# EAGLE schematic OSH_2018 (EAGLE 9.1.3)

## Sheet 1 of 4
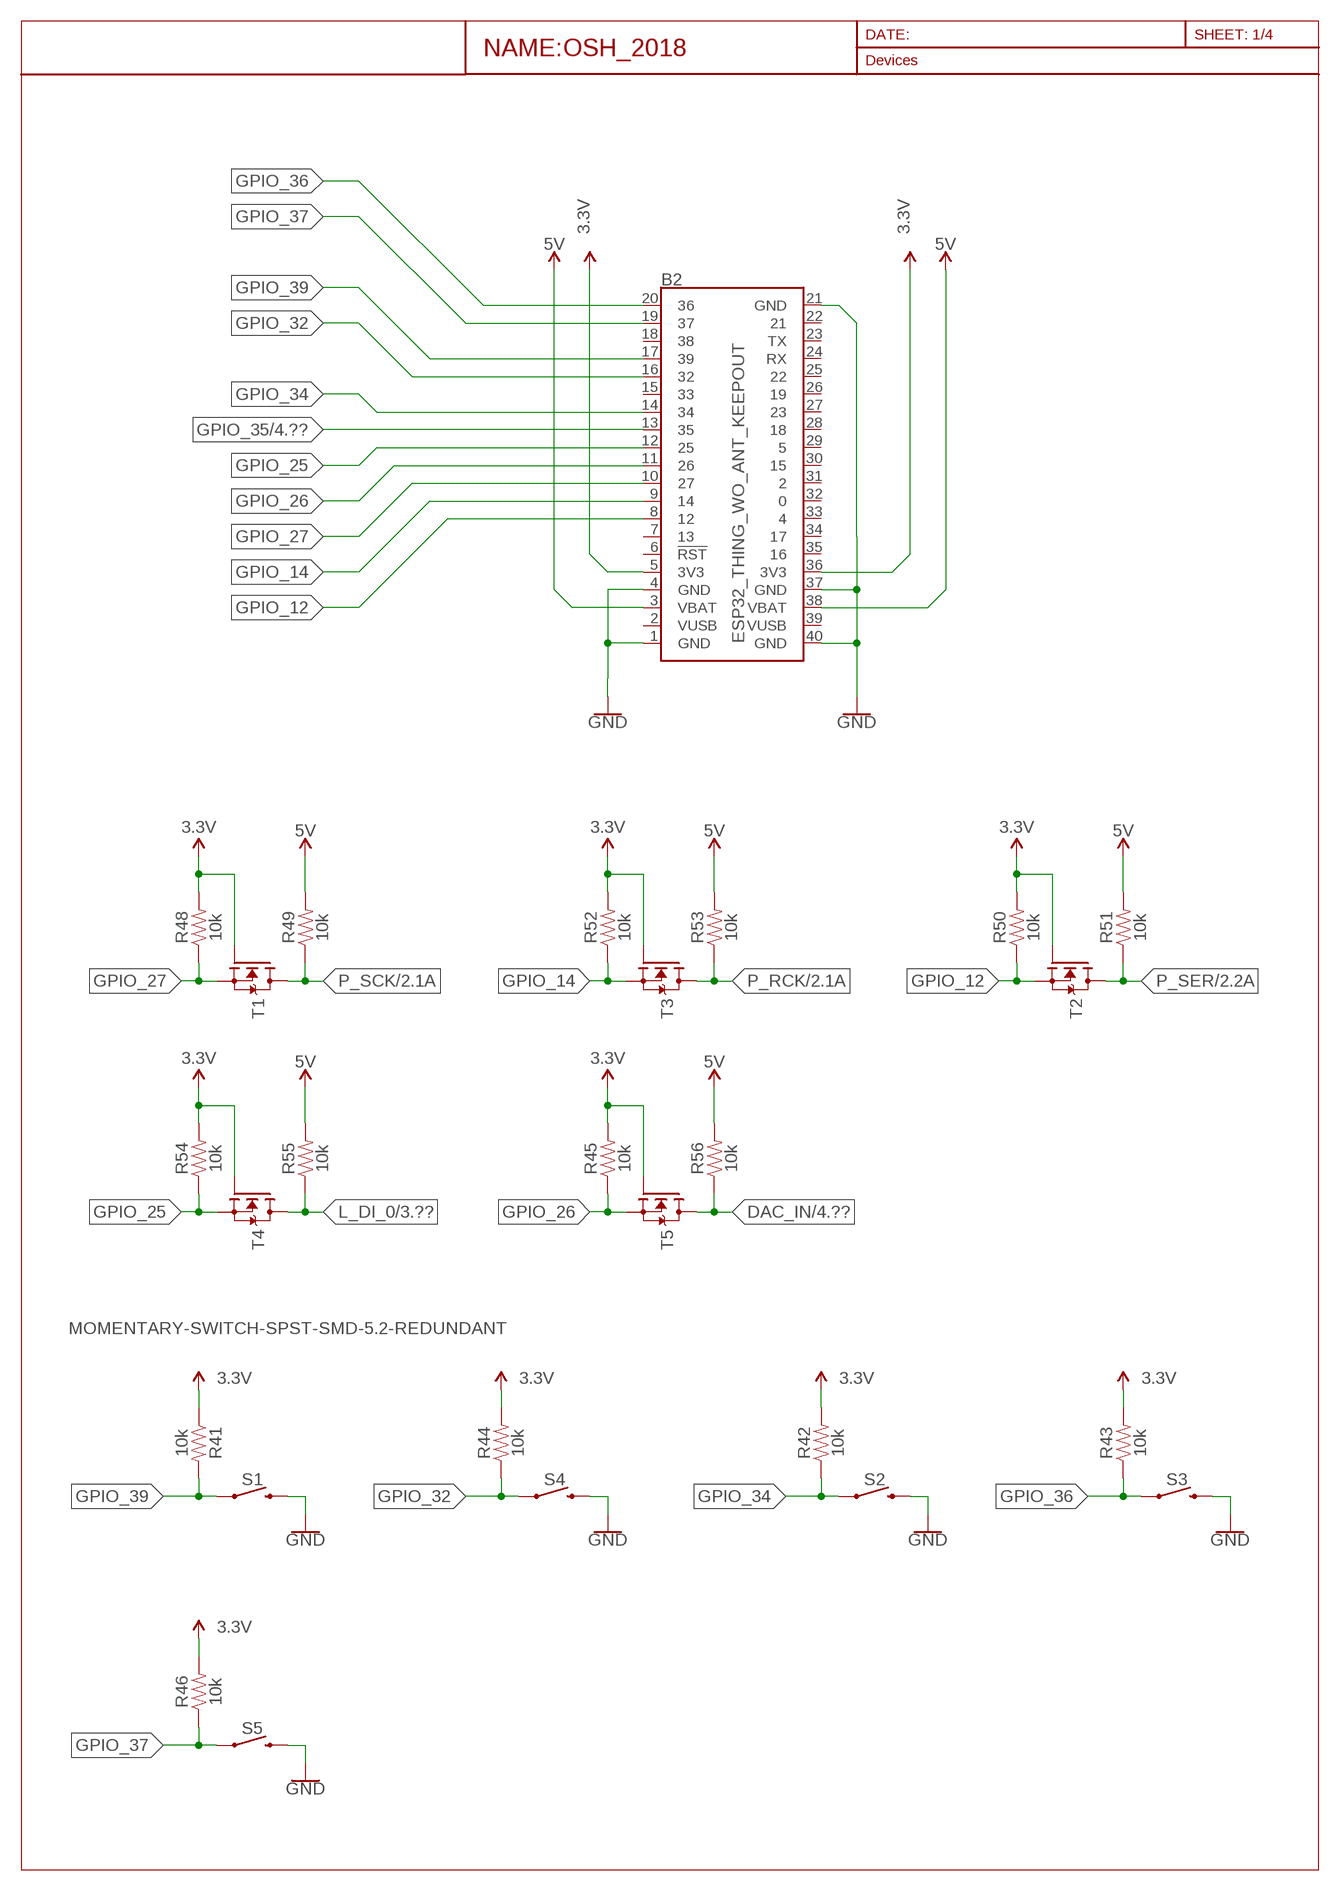
[diagram p0: schematic, sheet 1]

### Parts
B2  ESP32_THING_WO_ANT_KEEPOUT  [ESP32_THING_NO_ANT]
R41  10k  10KOHM-0603-1/10W-1%  [0603]
R42  10k  10KOHM-0603-1/10W-1%  [0603]
R43  10k  10KOHM-0603-1/10W-1%  [0603]
R44  10k  10KOHM-0603-1/10W-1%  [0603]
R45  10k  10KOHM-0603-1/10W-1%  [0603]
R46  10k  10KOHM-0603-1/10W-1%  [0603]
R48  10k  10KOHM-0603-1/10W-1%  [0603]
R49  10k  10KOHM-0603-1/10W-1%  [0603]
R50  10k  10KOHM-0603-1/10W-1%  [0603]
R51  10k  10KOHM-0603-1/10W-1%  [0603]
R52  10k  10KOHM-0603-1/10W-1%  [0603]
R53  10k  10KOHM-0603-1/10W-1%  [0603]
R54  10k  10KOHM-0603-1/10W-1%  [0603]
R55  10k  10KOHM-0603-1/10W-1%  [0603]
R56  10k  10KOHM-0603-1/10W-1%  [0603]
S1  MOMENTARY-SWITCH-SPST-SMD-5.2-REDUNDANT  [TACTILE_SWITCH_SMD_5.2MM]
S2  MOMENTARY-SWITCH-SPST-SMD-5.2-REDUNDANT  [TACTILE_SWITCH_SMD_5.2MM]
S3  MOMENTARY-SWITCH-SPST-SMD-5.2-REDUNDANT  [TACTILE_SWITCH_SMD_5.2MM]
S4  MOMENTARY-SWITCH-SPST-SMD-5.2-REDUNDANT  [TACTILE_SWITCH_SMD_5.2MM]
S5  MOMENTARY-SWITCH-SPST-SMD-5.2-REDUNDANT  [TACTILE_SWITCH_SMD_5.2MM]
T1  MOSFET-N-SOT23  [SOT23]
T2  MOSFET-N-SOT23  [SOT23]
T3  MOSFET-N-SOT23  [SOT23]
T4  MOSFET-N-SOT23  [SOT23]
T5  MOSFET-N-SOT23  [SOT23]

### Nets
3.3V: B2.5(3V3) B2.36(3V3) R41.1 R42.2 R43.2 R44.2 R45.2 R46.2 R48.2 R50.2 R52.2 R54.2 T1.1(G) T2.1(G) T3.1(G) T4.1(G) T5.1(G)
5V: B2.3(VBAT) B2.38(VBAT) R49.2 R51.2 R53.2 R55.2 R56.2 ; also sheet 2,3,4
DAC_IN: R56.1 T5.3(D) ; also sheet 4
GND: B2.1(GND) B2.4(GND) B2.21(GND) B2.37(GND) B2.40(GND) S1.3 S1.4 S2.3 S2.4 S3.3 S3.4 S4.3 S4.4 S5.3 S5.4 ; also sheet 2,3,4
GPIO_12: B2.8 R50.1 T2.2(S)
GPIO_14: B2.9 R52.1 T3.2(S)
GPIO_25: B2.12 R54.1 T4.2(S)
GPIO_26: B2.11 R45.1 T5.2(S)
GPIO_27: B2.10 R48.1 T1.2(S)
GPIO_32: B2.16 R44.1 S4.1 S4.2
GPIO_34: B2.14 R42.1 S2.1 S2.2
GPIO_35: B2.13 ; also sheet 4
GPIO_36: B2.20 R43.1 S3.1 S3.2
GPIO_37: B2.19 R46.1 S5.1 S5.2
GPIO_39: B2.17 R41.2 S1.1 S1.2
L_DI_0: R55.1 T4.3(D) ; also sheet 3
P_RCK: R53.1 T3.3(D) ; also sheet 2
P_SCK: R49.1 T1.3(D) ; also sheet 2
P_SER: R51.1 T2.3(D) ; also sheet 2
Unconnected: B2.2(VUSB) B2.6(!RST!) B2.7 B2.15 B2.18 B2.22 B2.23(TX) B2.24(RX) B2.25 B2.26 B2.27 B2.28 B2.29 B2.30 B2.31 B2.32 B2.33 B2.34 B2.35 B2.39(VUSB)

## Sheet 2 of 4: Configuracion de display de 8 segmentos
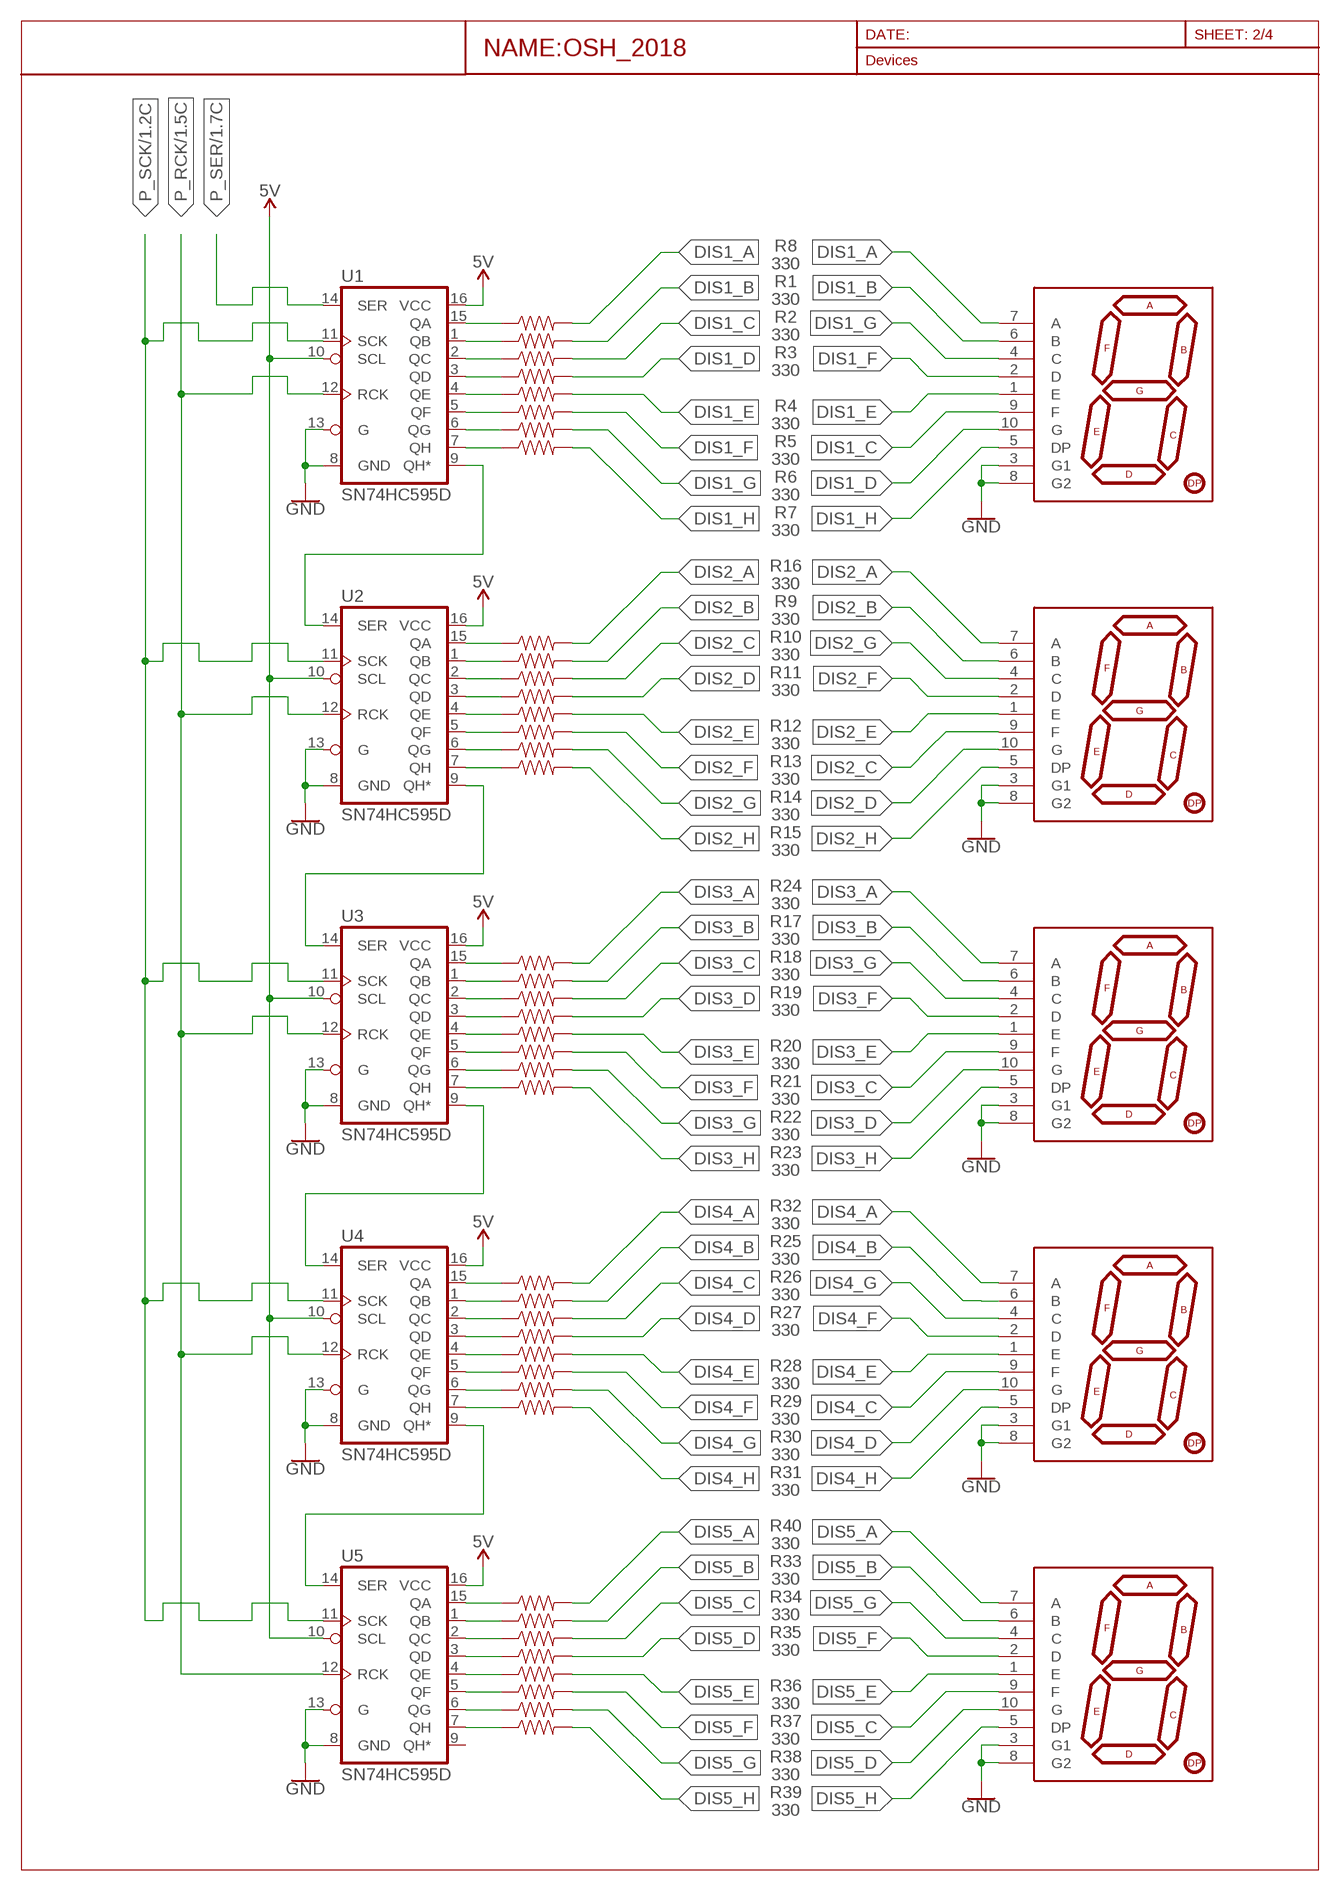
[diagram p1: schematic, sheet 2]

### Parts
DISPLAY_1  YSD-160AB3C-8  7-SEGMENT-1DIGIT-1INCH-BLUE  [7-SEGMENT-1"PTH]
DISPLAY_2  YSD-160AB3C-8  7-SEGMENT-1DIGIT-1INCH-BLUE  [7-SEGMENT-1"PTH]
DISPLAY_3  YSD-160AB3C-8  7-SEGMENT-1DIGIT-1INCH-BLUE  [7-SEGMENT-1"PTH]
DISPLAY_4  YSD-160AB3C-8  7-SEGMENT-1DIGIT-1INCH-BLUE  [7-SEGMENT-1"PTH]
DISPLAY_5  YSD-160AB3C-8  7-SEGMENT-1DIGIT-1INCH-BLUE  [7-SEGMENT-1"PTH]
R1  330  330OHM-0603-1/10W-1%  [0603]
R2  330  330OHM-0603-1/10W-1%  [0603]
R3  330  330OHM-0603-1/10W-1%  [0603]
R4  330  330OHM-0603-1/10W-1%  [0603]
R5  330  330OHM-0603-1/10W-1%  [0603]
R6  330  330OHM-0603-1/10W-1%  [0603]
R7  330  330OHM-0603-1/10W-1%  [0603]
R8  330  330OHM-0603-1/10W-1%  [0603]
R9  330  330OHM-0603-1/10W-1%  [0603]
R10  330  330OHM-0603-1/10W-1%  [0603]
R11  330  330OHM-0603-1/10W-1%  [0603]
R12  330  330OHM-0603-1/10W-1%  [0603]
R13  330  330OHM-0603-1/10W-1%  [0603]
R14  330  330OHM-0603-1/10W-1%  [0603]
R15  330  330OHM-0603-1/10W-1%  [0603]
R16  330  330OHM-0603-1/10W-1%  [0603]
R17  330  330OHM-0603-1/10W-1%  [0603]
R18  330  330OHM-0603-1/10W-1%  [0603]
R19  330  330OHM-0603-1/10W-1%  [0603]
R20  330  330OHM-0603-1/10W-1%  [0603]
R21  330  330OHM-0603-1/10W-1%  [0603]
R22  330  330OHM-0603-1/10W-1%  [0603]
R23  330  330OHM-0603-1/10W-1%  [0603]
R24  330  330OHM-0603-1/10W-1%  [0603]
R25  330  330OHM-0603-1/10W-1%  [0603]
R26  330  330OHM-0603-1/10W-1%  [0603]
R27  330  330OHM-0603-1/10W-1%  [0603]
R28  330  330OHM-0603-1/10W-1%  [0603]
R29  330  330OHM-0603-1/10W-1%  [0603]
R30  330  330OHM-0603-1/10W-1%  [0603]
R31  330  330OHM-0603-1/10W-1%  [0603]
R32  330  330OHM-0603-1/10W-1%  [0603]
R33  330  330OHM-0603-1/10W-1%  [0603]
R34  330  330OHM-0603-1/10W-1%  [0603]
R35  330  330OHM-0603-1/10W-1%  [0603]
R36  330  330OHM-0603-1/10W-1%  [0603]
R37  330  330OHM-0603-1/10W-1%  [0603]
R38  330  330OHM-0603-1/10W-1%  [0603]
R39  330  330OHM-0603-1/10W-1%  [0603]
R40  330  330OHM-0603-1/10W-1%  [0603]
U1  SN74HC595D  74HC595D  [SO16]
U2  SN74HC595D  74HC595D  [SO16]
U3  SN74HC595D  74HC595D  [SO16]
U4  SN74HC595D  74HC595D  [SO16]
U5  SN74HC595D  74HC595D  [SO16]

### Nets
5V: U1.10(SCL) U1.16(VCC) U2.10(SCL) U2.16(VCC) U3.10(SCL) U3.16(VCC) U4.10(SCL) U4.16(VCC) U5.10(SCL) U5.16(VCC) ; also sheet 1,3,4
DIS1_A: DISPLAY_1.7(A) R8.2
DIS1_B: DISPLAY_1.6(B) R1.2
DIS1_C: DISPLAY_1.9(F) R2.2
DIS1_D: DISPLAY_1.10(G) R3.2
DIS1_E: DISPLAY_1.1(E) R4.2
DIS1_F: DISPLAY_1.2(D) R5.2
DIS1_G: DISPLAY_1.4(C) R6.2
DIS1_H: DISPLAY_1.5(DP) R7.2
DIS2_A: DISPLAY_2.7(A) R9.2
DIS2_B: DISPLAY_2.6(B) R10.2
DIS2_C: DISPLAY_2.9(F) R11.2
DIS2_D: DISPLAY_2.10(G) R12.2
DIS2_E: DISPLAY_2.1(E) R13.2
DIS2_F: DISPLAY_2.2(D) R14.2
DIS2_G: DISPLAY_2.4(C) R15.2
DIS2_H: DISPLAY_2.5(DP) R16.2
DIS3_A: DISPLAY_3.7(A) R17.2
DIS3_B: DISPLAY_3.6(B) R18.2
DIS3_C: DISPLAY_3.9(F) R19.2
DIS3_D: DISPLAY_3.10(G) R20.2
DIS3_E: DISPLAY_3.1(E) R21.2
DIS3_F: DISPLAY_3.2(D) R22.2
DIS3_G: DISPLAY_3.4(C) R23.2
DIS3_H: DISPLAY_3.5(DP) R24.2
DIS4_A: DISPLAY_4.7(A) R25.2
DIS4_B: DISPLAY_4.6(B) R26.2
DIS4_C: DISPLAY_4.9(F) R27.2
DIS4_D: DISPLAY_4.10(G) R28.2
DIS4_E: DISPLAY_4.1(E) R29.2
DIS4_F: DISPLAY_4.2(D) R30.2
DIS4_G: DISPLAY_4.4(C) R31.2
DIS4_H: DISPLAY_4.5(DP) R32.2
DIS5_A: DISPLAY_5.7(A) R33.2
DIS5_B: DISPLAY_5.6(B) R34.2
DIS5_C: DISPLAY_5.9(F) R35.2
DIS5_D: DISPLAY_5.10(G) R36.2
DIS5_E: DISPLAY_5.1(E) R37.2
DIS5_F: DISPLAY_5.2(D) R38.2
DIS5_G: DISPLAY_5.4(C) R39.2
DIS5_H: DISPLAY_5.5(DP) R40.2
GND: DISPLAY_1.3(G1) DISPLAY_1.8(G2) DISPLAY_2.3(G1) DISPLAY_2.8(G2) DISPLAY_3.3(G1) DISPLAY_3.8(G2) DISPLAY_4.3(G1) DISPLAY_4.8(G2) DISPLAY_5.3(G1) DISPLAY_5.8(G2) U1.8(GND) U1.13(G) U2.8(GND) U2.13(G) U3.8(GND) U3.13(G) U4.8(GND) U4.13(G) U5.8(GND) U5.13(G) ; also sheet 1,3,4
N$110: R8.1 U1.15(QA)
N$121: R1.1 U1.1(QB)
N$122: R2.1 U1.2(QC)
N$123: R3.1 U1.3(QD)
N$124: R4.1 U1.4(QE)
N$125: R5.1 U1.5(QF)
N$126: R6.1 U1.6(QG)
N$127: R7.1 U1.7(QH)
N$141: R9.1 U2.15(QA)
N$142: R10.1 U2.1(QB)
N$143: R11.1 U2.2(QC)
N$144: R12.1 U2.3(QD)
N$145: R13.1 U2.4(QE)
N$146: R14.1 U2.5(QF)
N$157: R15.1 U2.6(QG)
N$158: R16.1 U2.7(QH)
N$177: R17.1 U3.15(QA)
N$178: R18.1 U3.1(QB)
N$179: R19.1 U3.2(QC)
N$180: R20.1 U3.3(QD)
N$181: R21.1 U3.4(QE)
N$182: R22.1 U3.5(QF)
N$193: R23.1 U3.6(QG)
N$194: R24.1 U3.7(QH)
N$195: R25.1 U4.15(QA)
N$196: R26.1 U4.1(QB)
N$221: R27.1 U4.2(QC)
N$222: R28.1 U4.3(QD)
N$223: R29.1 U4.4(QE)
N$224: R30.1 U4.5(QF)
N$225: R31.1 U4.6(QG)
N$226: R32.1 U4.7(QH)
N$235: R33.1 U5.15(QA)
N$236: R34.1 U5.1(QB)
N$237: R35.1 U5.2(QC)
N$238: R36.1 U5.3(QD)
N$239: R37.1 U5.4(QE)
N$240: R38.1 U5.5(QF)
N$241: R39.1 U5.6(QG)
N$242: R40.1 U5.7(QH)
N$251: U1.9(QH*) U2.14(SER)
N$252: U2.9(QH*) U3.14(SER)
N$253: U3.9(QH*) U4.14(SER)
N$254: U4.9(QH*) U5.14(SER)
P_RCK: U1.12(RCK) U2.12(RCK) U3.12(RCK) U4.12(RCK) U5.12(RCK) ; also sheet 1
P_SCK: U1.11(SCK) U2.11(SCK) U3.11(SCK) U4.11(SCK) U5.11(SCK) ; also sheet 1
P_SER: U1.14(SER) ; also sheet 1
Unconnected: U5.9(QH*)

## Sheet 3 of 4: Matrix LED 15x15
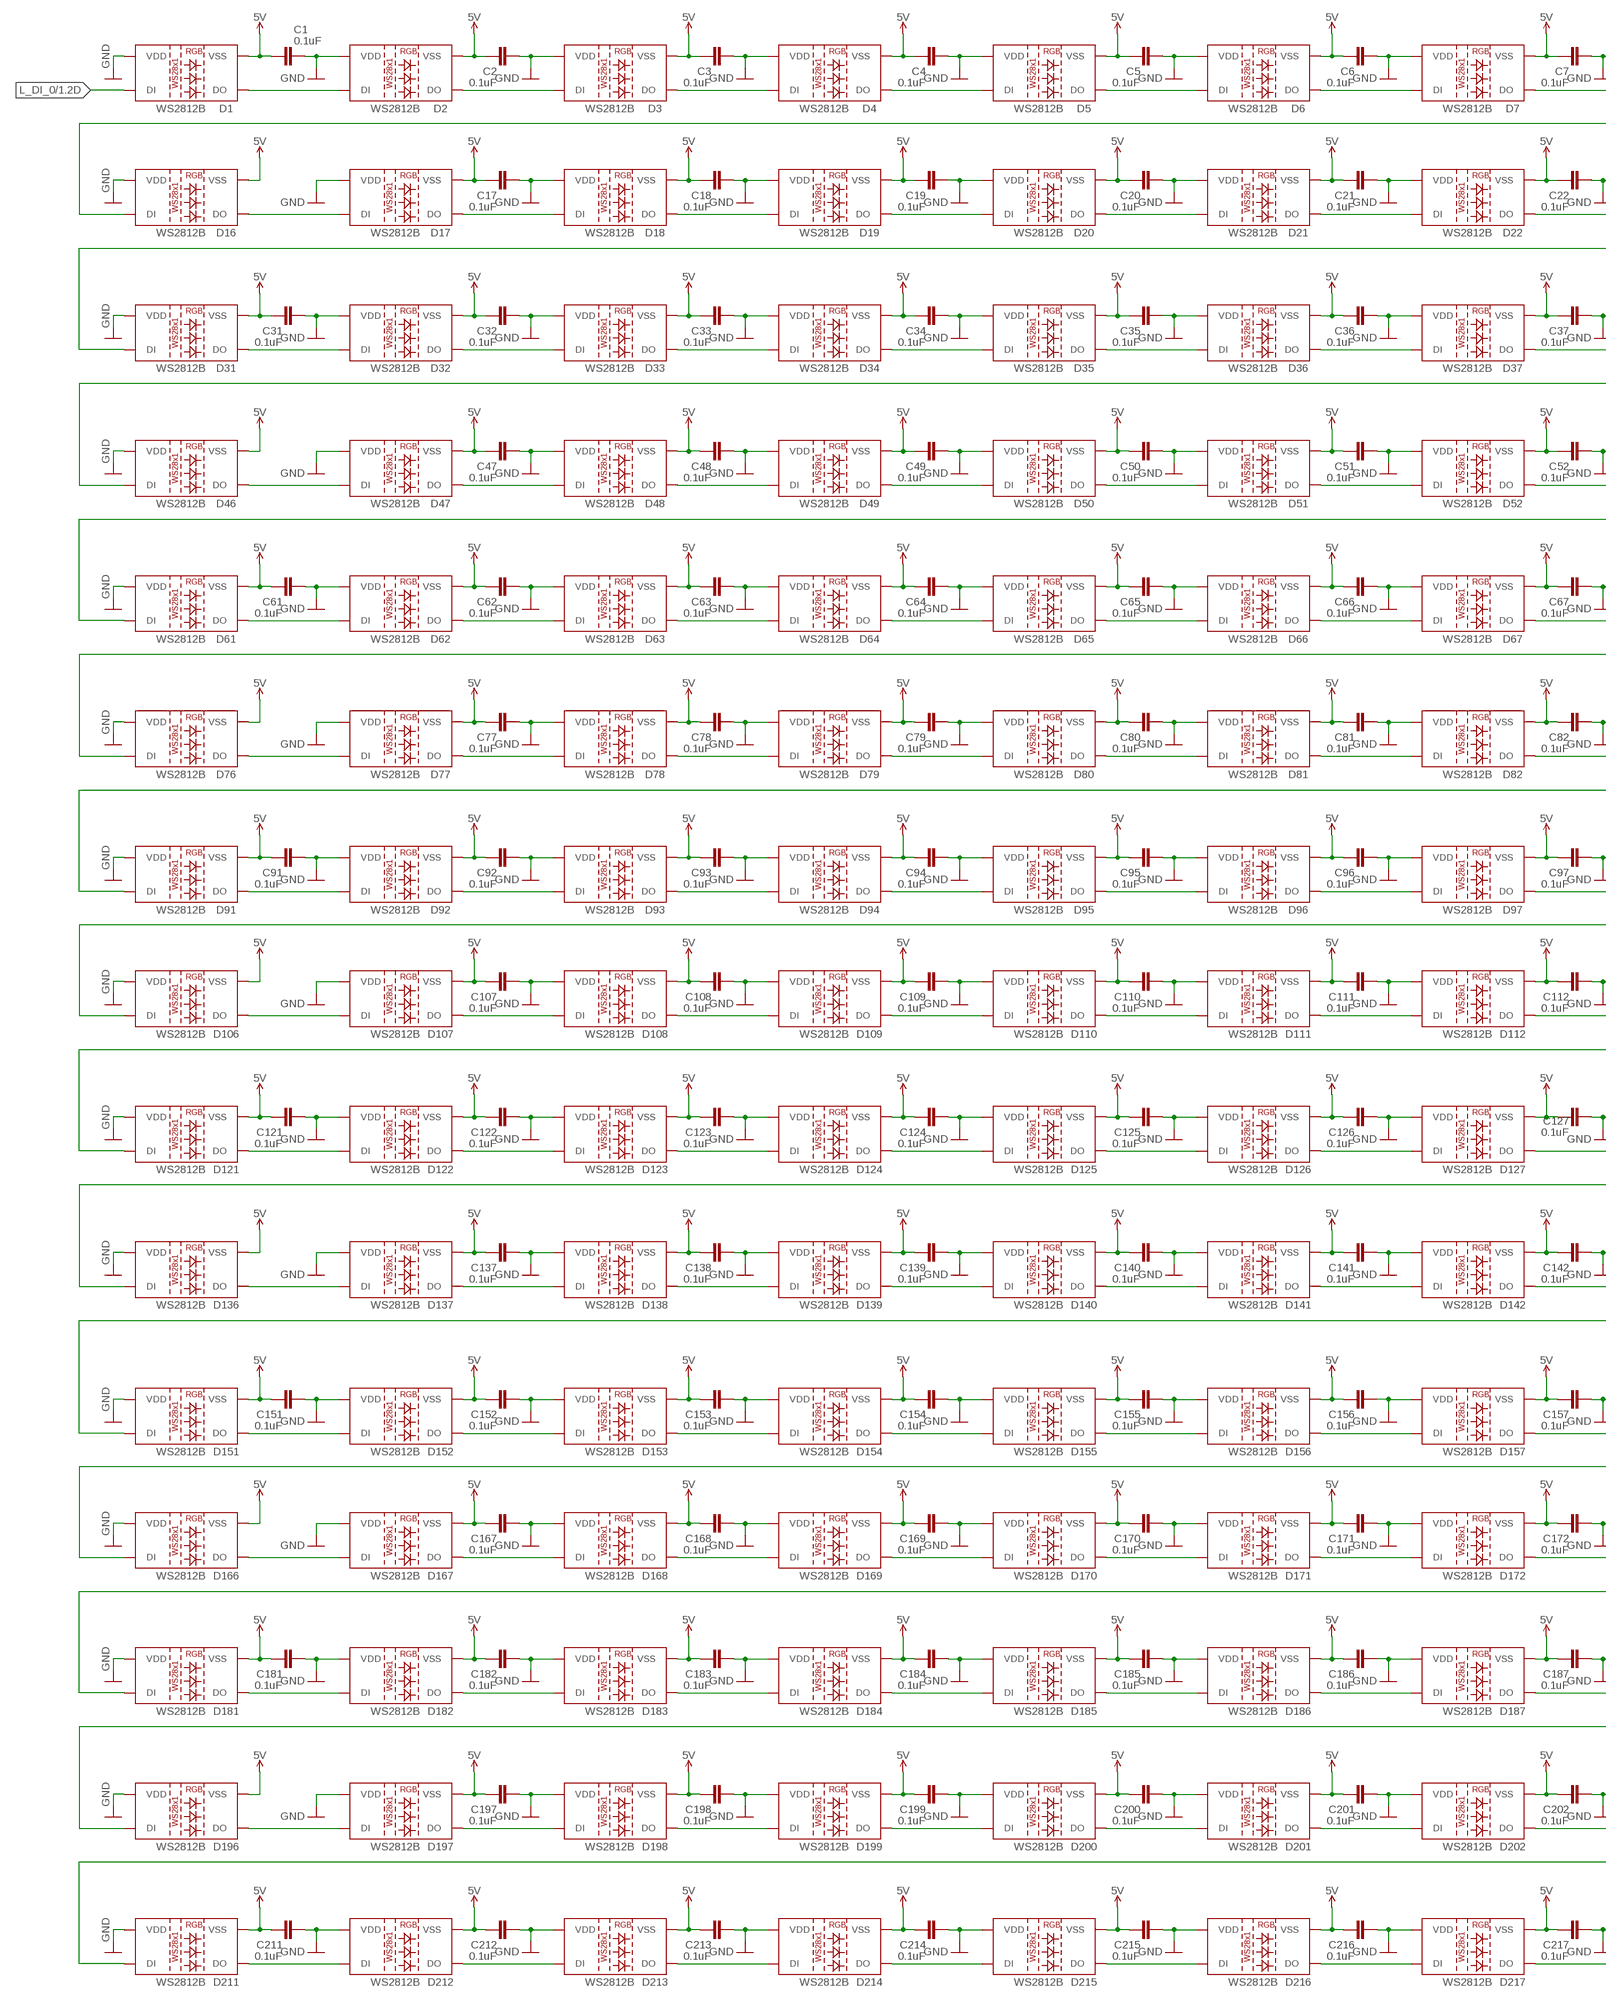
[diagram p2: schematic, sheet 3, part 1 of 2]
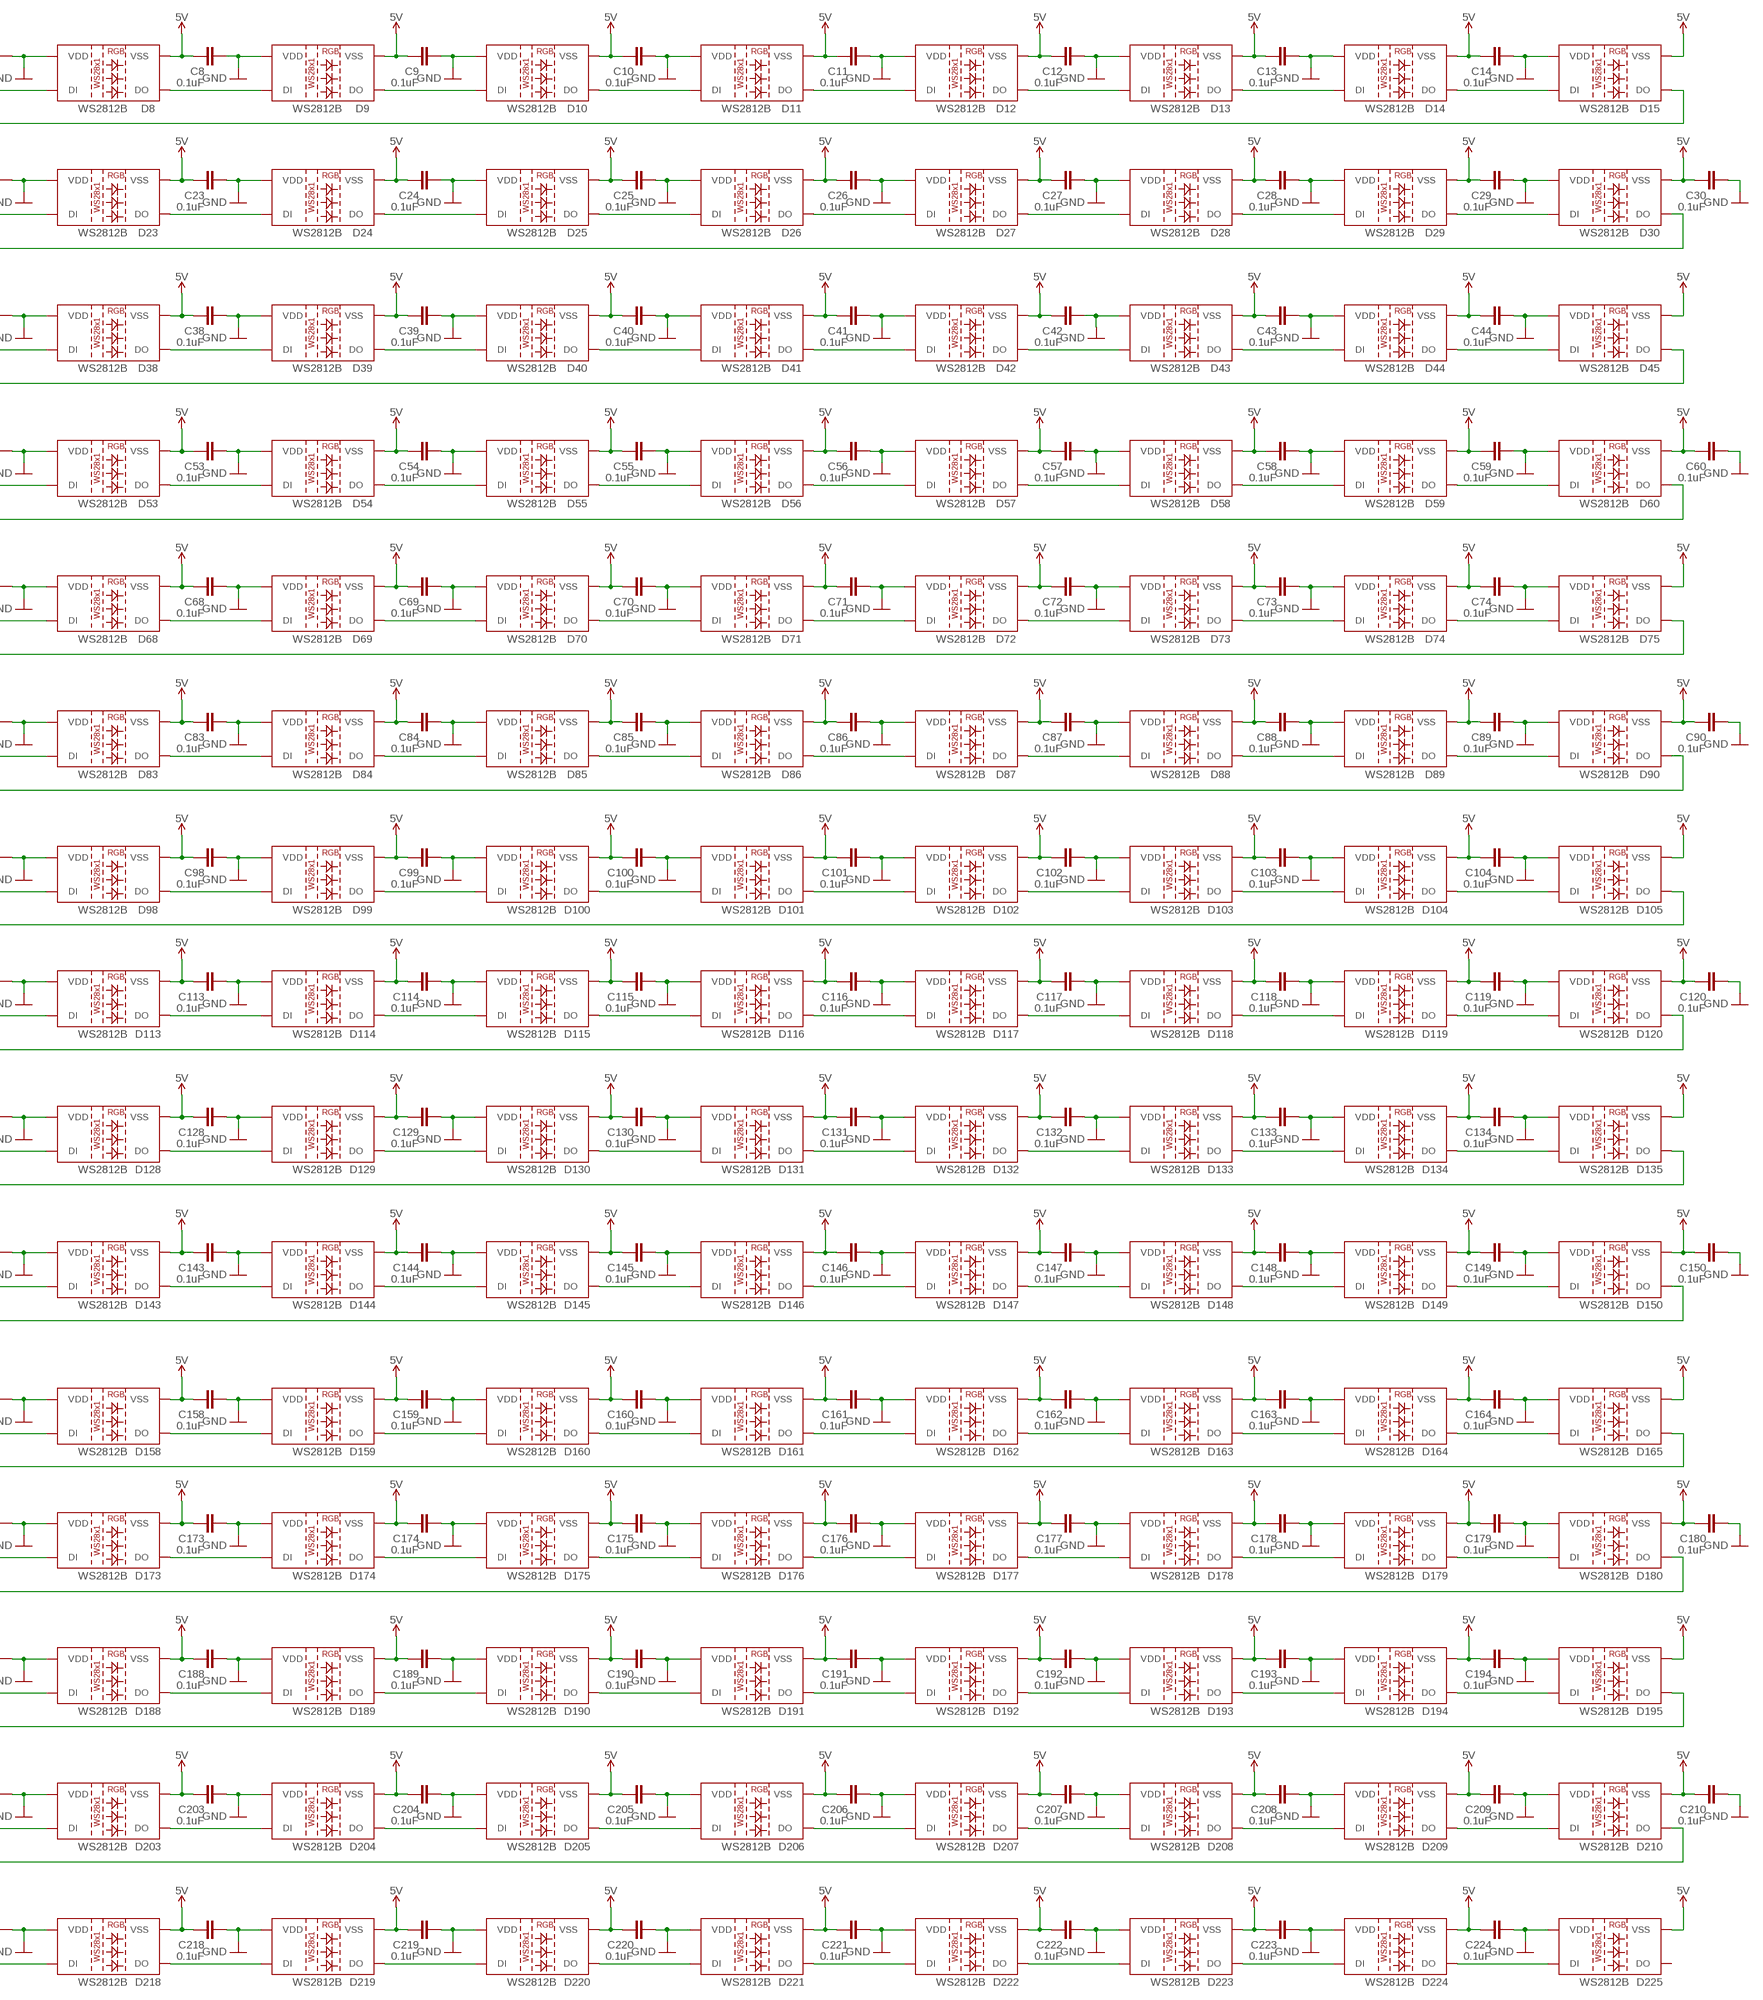
[diagram p3: schematic, sheet 3, part 2 of 2]

### Parts
C1  0.1uF  0.1UF-0603-25V-5%  [0603]
C2  0.1uF  0.1UF-0603-25V-5%  [0603]
C3  0.1uF  0.1UF-0603-25V-5%  [0603]
C4  0.1uF  0.1UF-0603-25V-5%  [0603]
C5  0.1uF  0.1UF-0603-25V-5%  [0603]
C6  0.1uF  0.1UF-0603-25V-5%  [0603]
C7  0.1uF  0.1UF-0603-25V-5%  [0603]
C8  0.1uF  0.1UF-0603-25V-5%  [0603]
C9  0.1uF  0.1UF-0603-25V-5%  [0603]
C10  0.1uF  0.1UF-0603-25V-5%  [0603]
C11  0.1uF  0.1UF-0603-25V-5%  [0603]
C12  0.1uF  0.1UF-0603-25V-5%  [0603]
C13  0.1uF  0.1UF-0603-25V-5%  [0603]
C14  0.1uF  0.1UF-0603-25V-5%  [0603]
C17  0.1uF  0.1UF-0603-25V-5%  [0603]
C18  0.1uF  0.1UF-0603-25V-5%  [0603]
C19  0.1uF  0.1UF-0603-25V-5%  [0603]
C20  0.1uF  0.1UF-0603-25V-5%  [0603]
C21  0.1uF  0.1UF-0603-25V-5%  [0603]
C22  0.1uF  0.1UF-0603-25V-5%  [0603]
C23  0.1uF  0.1UF-0603-25V-5%  [0603]
C24  0.1uF  0.1UF-0603-25V-5%  [0603]
C25  0.1uF  0.1UF-0603-25V-5%  [0603]
C26  0.1uF  0.1UF-0603-25V-5%  [0603]
C27  0.1uF  0.1UF-0603-25V-5%  [0603]
C28  0.1uF  0.1UF-0603-25V-5%  [0603]
C29  0.1uF  0.1UF-0603-25V-5%  [0603]
C30  0.1uF  0.1UF-0603-25V-5%  [0603]
C31  0.1uF  0.1UF-0603-25V-5%  [0603]
C32  0.1uF  0.1UF-0603-25V-5%  [0603]
C33  0.1uF  0.1UF-0603-25V-5%  [0603]
C34  0.1uF  0.1UF-0603-25V-5%  [0603]
C35  0.1uF  0.1UF-0603-25V-5%  [0603]
C36  0.1uF  0.1UF-0603-25V-5%  [0603]
C37  0.1uF  0.1UF-0603-25V-5%  [0603]
C38  0.1uF  0.1UF-0603-25V-5%  [0603]
C39  0.1uF  0.1UF-0603-25V-5%  [0603]
C40  0.1uF  0.1UF-0603-25V-5%  [0603]
C41  0.1uF  0.1UF-0603-25V-5%  [0603]
C42  0.1uF  0.1UF-0603-25V-5%  [0603]
C43  0.1uF  0.1UF-0603-25V-5%  [0603]
C44  0.1uF  0.1UF-0603-25V-5%  [0603]
C47  0.1uF  0.1UF-0603-25V-5%  [0603]
C48  0.1uF  0.1UF-0603-25V-5%  [0603]
C49  0.1uF  0.1UF-0603-25V-5%  [0603]
C50  0.1uF  0.1UF-0603-25V-5%  [0603]
C51  0.1uF  0.1UF-0603-25V-5%  [0603]
C52  0.1uF  0.1UF-0603-25V-5%  [0603]
C53  0.1uF  0.1UF-0603-25V-5%  [0603]
C54  0.1uF  0.1UF-0603-25V-5%  [0603]
C55  0.1uF  0.1UF-0603-25V-5%  [0603]
C56  0.1uF  0.1UF-0603-25V-5%  [0603]
C57  0.1uF  0.1UF-0603-25V-5%  [0603]
C58  0.1uF  0.1UF-0603-25V-5%  [0603]
C59  0.1uF  0.1UF-0603-25V-5%  [0603]
C60  0.1uF  0.1UF-0603-25V-5%  [0603]
C61  0.1uF  0.1UF-0603-25V-5%  [0603]
C62  0.1uF  0.1UF-0603-25V-5%  [0603]
C63  0.1uF  0.1UF-0603-25V-5%  [0603]
C64  0.1uF  0.1UF-0603-25V-5%  [0603]
C65  0.1uF  0.1UF-0603-25V-5%  [0603]
C66  0.1uF  0.1UF-0603-25V-5%  [0603]
C67  0.1uF  0.1UF-0603-25V-5%  [0603]
C68  0.1uF  0.1UF-0603-25V-5%  [0603]
C69  0.1uF  0.1UF-0603-25V-5%  [0603]
C70  0.1uF  0.1UF-0603-25V-5%  [0603]
C71  0.1uF  0.1UF-0603-25V-5%  [0603]
C72  0.1uF  0.1UF-0603-25V-5%  [0603]
C73  0.1uF  0.1UF-0603-25V-5%  [0603]
C74  0.1uF  0.1UF-0603-25V-5%  [0603]
C77  0.1uF  0.1UF-0603-25V-5%  [0603]
C78  0.1uF  0.1UF-0603-25V-5%  [0603]
C79  0.1uF  0.1UF-0603-25V-5%  [0603]
C80  0.1uF  0.1UF-0603-25V-5%  [0603]
C81  0.1uF  0.1UF-0603-25V-5%  [0603]
C82  0.1uF  0.1UF-0603-25V-5%  [0603]
C83  0.1uF  0.1UF-0603-25V-5%  [0603]
C84  0.1uF  0.1UF-0603-25V-5%  [0603]
C85  0.1uF  0.1UF-0603-25V-5%  [0603]
C86  0.1uF  0.1UF-0603-25V-5%  [0603]
C87  0.1uF  0.1UF-0603-25V-5%  [0603]
C88  0.1uF  0.1UF-0603-25V-5%  [0603]
C89  0.1uF  0.1UF-0603-25V-5%  [0603]
C90  0.1uF  0.1UF-0603-25V-5%  [0603]
C91  0.1uF  0.1UF-0603-25V-5%  [0603]
C92  0.1uF  0.1UF-0603-25V-5%  [0603]
C93  0.1uF  0.1UF-0603-25V-5%  [0603]
C94  0.1uF  0.1UF-0603-25V-5%  [0603]
C95  0.1uF  0.1UF-0603-25V-5%  [0603]
C96  0.1uF  0.1UF-0603-25V-5%  [0603]
C97  0.1uF  0.1UF-0603-25V-5%  [0603]
C98  0.1uF  0.1UF-0603-25V-5%  [0603]
C99  0.1uF  0.1UF-0603-25V-5%  [0603]
C100  0.1uF  0.1UF-0603-25V-5%  [0603]
C101  0.1uF  0.1UF-0603-25V-5%  [0603]
C102  0.1uF  0.1UF-0603-25V-5%  [0603]
C103  0.1uF  0.1UF-0603-25V-5%  [0603]
C104  0.1uF  0.1UF-0603-25V-5%  [0603]
C107  0.1uF  0.1UF-0603-25V-5%  [0603]
C108  0.1uF  0.1UF-0603-25V-5%  [0603]
C109  0.1uF  0.1UF-0603-25V-5%  [0603]
C110  0.1uF  0.1UF-0603-25V-5%  [0603]
C111  0.1uF  0.1UF-0603-25V-5%  [0603]
C112  0.1uF  0.1UF-0603-25V-5%  [0603]
C113  0.1uF  0.1UF-0603-25V-5%  [0603]
C114  0.1uF  0.1UF-0603-25V-5%  [0603]
C115  0.1uF  0.1UF-0603-25V-5%  [0603]
C116  0.1uF  0.1UF-0603-25V-5%  [0603]
C117  0.1uF  0.1UF-0603-25V-5%  [0603]
C118  0.1uF  0.1UF-0603-25V-5%  [0603]
C119  0.1uF  0.1UF-0603-25V-5%  [0603]
C120  0.1uF  0.1UF-0603-25V-5%  [0603]
C121  0.1uF  0.1UF-0603-25V-5%  [0603]
C122  0.1uF  0.1UF-0603-25V-5%  [0603]
C123  0.1uF  0.1UF-0603-25V-5%  [0603]
C124  0.1uF  0.1UF-0603-25V-5%  [0603]
C125  0.1uF  0.1UF-0603-25V-5%  [0603]
C126  0.1uF  0.1UF-0603-25V-5%  [0603]
C127  0.1uF  0.1UF-0603-25V-5%  [0603]
C128  0.1uF  0.1UF-0603-25V-5%  [0603]
C129  0.1uF  0.1UF-0603-25V-5%  [0603]
C130  0.1uF  0.1UF-0603-25V-5%  [0603]
C131  0.1uF  0.1UF-0603-25V-5%  [0603]
C132  0.1uF  0.1UF-0603-25V-5%  [0603]
C133  0.1uF  0.1UF-0603-25V-5%  [0603]
C134  0.1uF  0.1UF-0603-25V-5%  [0603]
C137  0.1uF  0.1UF-0603-25V-5%  [0603]
C138  0.1uF  0.1UF-0603-25V-5%  [0603]
C139  0.1uF  0.1UF-0603-25V-5%  [0603]
C140  0.1uF  0.1UF-0603-25V-5%  [0603]
C141  0.1uF  0.1UF-0603-25V-5%  [0603]
C142  0.1uF  0.1UF-0603-25V-5%  [0603]
C143  0.1uF  0.1UF-0603-25V-5%  [0603]
C144  0.1uF  0.1UF-0603-25V-5%  [0603]
C145  0.1uF  0.1UF-0603-25V-5%  [0603]
C146  0.1uF  0.1UF-0603-25V-5%  [0603]
C147  0.1uF  0.1UF-0603-25V-5%  [0603]
C148  0.1uF  0.1UF-0603-25V-5%  [0603]
C149  0.1uF  0.1UF-0603-25V-5%  [0603]
C150  0.1uF  0.1UF-0603-25V-5%  [0603]
C151  0.1uF  0.1UF-0603-25V-5%  [0603]
C152  0.1uF  0.1UF-0603-25V-5%  [0603]
C153  0.1uF  0.1UF-0603-25V-5%  [0603]
C154  0.1uF  0.1UF-0603-25V-5%  [0603]
C155  0.1uF  0.1UF-0603-25V-5%  [0603]
C156  0.1uF  0.1UF-0603-25V-5%  [0603]
C157  0.1uF  0.1UF-0603-25V-5%  [0603]
C158  0.1uF  0.1UF-0603-25V-5%  [0603]
C159  0.1uF  0.1UF-0603-25V-5%  [0603]
C160  0.1uF  0.1UF-0603-25V-5%  [0603]
C161  0.1uF  0.1UF-0603-25V-5%  [0603]
C162  0.1uF  0.1UF-0603-25V-5%  [0603]
C163  0.1uF  0.1UF-0603-25V-5%  [0603]
C164  0.1uF  0.1UF-0603-25V-5%  [0603]
C167  0.1uF  0.1UF-0603-25V-5%  [0603]
C168  0.1uF  0.1UF-0603-25V-5%  [0603]
C169  0.1uF  0.1UF-0603-25V-5%  [0603]
C170  0.1uF  0.1UF-0603-25V-5%  [0603]
C171  0.1uF  0.1UF-0603-25V-5%  [0603]
C172  0.1uF  0.1UF-0603-25V-5%  [0603]
C173  0.1uF  0.1UF-0603-25V-5%  [0603]
C174  0.1uF  0.1UF-0603-25V-5%  [0603]
C175  0.1uF  0.1UF-0603-25V-5%  [0603]
C176  0.1uF  0.1UF-0603-25V-5%  [0603]
C177  0.1uF  0.1UF-0603-25V-5%  [0603]
C178  0.1uF  0.1UF-0603-25V-5%  [0603]
C179  0.1uF  0.1UF-0603-25V-5%  [0603]
C180  0.1uF  0.1UF-0603-25V-5%  [0603]
C181  0.1uF  0.1UF-0603-25V-5%  [0603]
C182  0.1uF  0.1UF-0603-100V-10%  [0603]
C183  0.1uF  0.1UF-0603-25V-5%  [0603]
C184  0.1uF  0.1UF-0603-25V-5%  [0603]
C185  0.1uF  0.1UF-0603-25V-5%  [0603]
C186  0.1uF  0.1UF-0603-25V-5%  [0603]
C187  0.1uF  0.1UF-0603-25V-5%  [0603]
C188  0.1uF  0.1UF-0603-25V-5%  [0603]
C189  0.1uF  0.1UF-0603-25V-5%  [0603]
C190  0.1uF  0.1UF-0603-25V-5%  [0603]
C191  0.1uF  0.1UF-0603-25V-5%  [0603]
C192  0.1uF  0.1UF-0603-25V-5%  [0603]
C193  0.1uF  0.1UF-0603-25V-5%  [0603]
C194  0.1uF  0.1UF-0603-25V-5%  [0603]
C197  0.1uF  0.1UF-0603-25V-5%  [0603]
C198  0.1uF  0.1UF-0603-25V-5%  [0603]
C199  0.1uF  0.1UF-0603-25V-5%  [0603]
C200  0.1uF  0.1UF-0603-25V-5%  [0603]
C201  0.1uF  0.1UF-0603-25V-5%  [0603]
C202  0.1uF  0.1UF-0603-25V-5%  [0603]
C203  0.1uF  0.1UF-0603-25V-5%  [0603]
C204  0.1uF  0.1UF-0603-25V-5%  [0603]
C205  0.1uF  0.1UF-0603-25V-5%  [0603]
C206  0.1uF  0.1UF-0603-25V-5%  [0603]
C207  0.1uF  0.1UF-0603-25V-5%  [0603]
C208  0.1uF  0.1UF-0603-25V-5%  [0603]
C209  0.1uF  0.1UF-0603-25V-5%  [0603]
C210  0.1uF  0.1UF-0603-25V-5%  [0603]
C211  0.1uF  0.1UF-0603-25V-5%  [0603]
C212  0.1uF  0.1UF-0603-25V-5%  [0603]
C213  0.1uF  0.1UF-0603-25V-5%  [0603]
C214  0.1uF  0.1UF-0603-25V-5%  [0603]
C215  0.1uF  0.1UF-0603-25V-5%  [0603]
C216  0.1uF  0.1UF-0603-25V-5%  [0603]
C217  0.1uF  0.1UF-0603-25V-5%  [0603]
C218  0.1uF  0.1UF-0603-25V-5%  [0603]
C219  0.1uF  0.1UF-0603-25V-5%  [0603]
C220  0.1uF  0.1UF-0603-25V-5%  [0603]
C221  0.1uF  0.1UF-0603-25V-5%  [0603]
C222  0.1uF  0.1UF-0603-25V-5%  [0603]
C223  0.1uF  0.1UF-0603-25V-5%  [0603]
C224  0.1uF  0.1UF-0603-25V-5%  [0603]
D1  WS2812B  [WS2812B]
D2  WS2812B  [WS2812B]
D3  WS2812B  [WS2812B]
D4  WS2812B  [WS2812B]
D5  WS2812B  [WS2812B]
D6  WS2812B  [WS2812B]
D7  WS2812B  [WS2812B]
D8  WS2812B  [WS2812B]
D9  WS2812B  [WS2812B]
D10  WS2812B  [WS2812B]
D11  WS2812B  [WS2812B]
D12  WS2812B  [WS2812B]
D13  WS2812B  [WS2812B]
D14  WS2812B  [WS2812B]
D15  WS2812B  [WS2812B]
D16  WS2812B  [WS2812B]
D17  WS2812B  [WS2812B]
D18  WS2812B  [WS2812B]
D19  WS2812B  [WS2812B]
D20  WS2812B  [WS2812B]
D21  WS2812B  [WS2812B]
D22  WS2812B  [WS2812B]
D23  WS2812B  [WS2812B]
D24  WS2812B  [WS2812B]
D25  WS2812B  [WS2812B]
D26  WS2812B  [WS2812B]
D27  WS2812B  [WS2812B]
D28  WS2812B  [WS2812B]
D29  WS2812B  [WS2812B]
D30  WS2812B  [WS2812B]
D31  WS2812B  [WS2812B]
D32  WS2812B  [WS2812B]
D33  WS2812B  [WS2812B]
D34  WS2812B  [WS2812B]
D35  WS2812B  [WS2812B]
D36  WS2812B  [WS2812B]
D37  WS2812B  [WS2812B]
D38  WS2812B  [WS2812B]
D39  WS2812B  [WS2812B]
D40  WS2812B  [WS2812B]
D41  WS2812B  [WS2812B]
D42  WS2812B  [WS2812B]
D43  WS2812B  [WS2812B]
D44  WS2812B  [WS2812B]
D45  WS2812B  [WS2812B]
D46  WS2812B  [WS2812B]
D47  WS2812B  [WS2812B]
D48  WS2812B  [WS2812B]
D49  WS2812B  [WS2812B]
D50  WS2812B  [WS2812B]
D51  WS2812B  [WS2812B]
D52  WS2812B  [WS2812B]
D53  WS2812B  [WS2812B]
D54  WS2812B  [WS2812B]
D55  WS2812B  [WS2812B]
D56  WS2812B  [WS2812B]
D57  WS2812B  [WS2812B]
D58  WS2812B  [WS2812B]
D59  WS2812B  [WS2812B]
D60  WS2812B  [WS2812B]
D61  WS2812B  [WS2812B]
D62  WS2812B  [WS2812B]
D63  WS2812B  [WS2812B]
D64  WS2812B  [WS2812B]
D65  WS2812B  [WS2812B]
D66  WS2812B  [WS2812B]
D67  WS2812B  [WS2812B]
D68  WS2812B  [WS2812B]
D69  WS2812B  [WS2812B]
D70  WS2812B  [WS2812B]
D71  WS2812B  [WS2812B]
D72  WS2812B  [WS2812B]
D73  WS2812B  [WS2812B]
D74  WS2812B  [WS2812B]
D75  WS2812B  [WS2812B]
D76  WS2812B  [WS2812B]
D77  WS2812B  [WS2812B]
D78  WS2812B  [WS2812B]
D79  WS2812B  [WS2812B]
D80  WS2812B  [WS2812B]
D81  WS2812B  [WS2812B]
D82  WS2812B  [WS2812B]
D83  WS2812B  [WS2812B]
D84  WS2812B  [WS2812B]
D85  WS2812B  [WS2812B]
D86  WS2812B  [WS2812B]
D87  WS2812B  [WS2812B]
D88  WS2812B  [WS2812B]
D89  WS2812B  [WS2812B]
D90  WS2812B  [WS2812B]
D91  WS2812B  [WS2812B]
D92  WS2812B  [WS2812B]
D93  WS2812B  [WS2812B]
D94  WS2812B  [WS2812B]
D95  WS2812B  [WS2812B]
D96  WS2812B  [WS2812B]
D97  WS2812B  [WS2812B]
D98  WS2812B  [WS2812B]
D99  WS2812B  [WS2812B]
D100  WS2812B  [WS2812B]
D101  WS2812B  [WS2812B]
D102  WS2812B  [WS2812B]
D103  WS2812B  [WS2812B]
D104  WS2812B  [WS2812B]
D105  WS2812B  [WS2812B]
D106  WS2812B  [WS2812B]
D107  WS2812B  [WS2812B]
D108  WS2812B  [WS2812B]
D109  WS2812B  [WS2812B]
D110  WS2812B  [WS2812B]
D111  WS2812B  [WS2812B]
D112  WS2812B  [WS2812B]
D113  WS2812B  [WS2812B]
D114  WS2812B  [WS2812B]
D115  WS2812B  [WS2812B]
D116  WS2812B  [WS2812B]
D117  WS2812B  [WS2812B]
D118  WS2812B  [WS2812B]
D119  WS2812B  [WS2812B]
D120  WS2812B  [WS2812B]
D121  WS2812B  [WS2812B]
D122  WS2812B  [WS2812B]
D123  WS2812B  [WS2812B]
D124  WS2812B  [WS2812B]
D125  WS2812B  [WS2812B]
D126  WS2812B  [WS2812B]
D127  WS2812B  [WS2812B]
D128  WS2812B  [WS2812B]
D129  WS2812B  [WS2812B]
D130  WS2812B  [WS2812B]
D131  WS2812B  [WS2812B]
D132  WS2812B  [WS2812B]
D133  WS2812B  [WS2812B]
D134  WS2812B  [WS2812B]
D135  WS2812B  [WS2812B]
D136  WS2812B  [WS2812B]
D137  WS2812B  [WS2812B]
D138  WS2812B  [WS2812B]
D139  WS2812B  [WS2812B]
D140  WS2812B  [WS2812B]
D141  WS2812B  [WS2812B]
D142  WS2812B  [WS2812B]
D143  WS2812B  [WS2812B]
D144  WS2812B  [WS2812B]
D145  WS2812B  [WS2812B]
D146  WS2812B  [WS2812B]
D147  WS2812B  [WS2812B]
D148  WS2812B  [WS2812B]
D149  WS2812B  [WS2812B]
D150  WS2812B  [WS2812B]
D151  WS2812B  [WS2812B]
D152  WS2812B  [WS2812B]
D153  WS2812B  [WS2812B]
D154  WS2812B  [WS2812B]
D155  WS2812B  [WS2812B]
D156  WS2812B  [WS2812B]
D157  WS2812B  [WS2812B]
D158  WS2812B  [WS2812B]
D159  WS2812B  [WS2812B]
D160  WS2812B  [WS2812B]
D161  WS2812B  [WS2812B]
D162  WS2812B  [WS2812B]
D163  WS2812B  [WS2812B]
D164  WS2812B  [WS2812B]
D165  WS2812B  [WS2812B]
D166  WS2812B  [WS2812B]
D167  WS2812B  [WS2812B]
D168  WS2812B  [WS2812B]
D169  WS2812B  [WS2812B]
D170  WS2812B  [WS2812B]
D171  WS2812B  [WS2812B]
D172  WS2812B  [WS2812B]
D173  WS2812B  [WS2812B]
D174  WS2812B  [WS2812B]
D175  WS2812B  [WS2812B]
D176  WS2812B  [WS2812B]
D177  WS2812B  [WS2812B]
D178  WS2812B  [WS2812B]
D179  WS2812B  [WS2812B]
D180  WS2812B  [WS2812B]
D181  WS2812B  [WS2812B]
D182  WS2812B  [WS2812B]
D183  WS2812B  [WS2812B]
D184  WS2812B  [WS2812B]
D185  WS2812B  [WS2812B]
D186  WS2812B  [WS2812B]
D187  WS2812B  [WS2812B]
D188  WS2812B  [WS2812B]
D189  WS2812B  [WS2812B]
D190  WS2812B  [WS2812B]
D191  WS2812B  [WS2812B]
D192  WS2812B  [WS2812B]
D193  WS2812B  [WS2812B]
D194  WS2812B  [WS2812B]
D195  WS2812B  [WS2812B]
D196  WS2812B  [WS2812B]
D197  WS2812B  [WS2812B]
D198  WS2812B  [WS2812B]
D199  WS2812B  [WS2812B]
D200  WS2812B  [WS2812B]
D201  WS2812B  [WS2812B]
D202  WS2812B  [WS2812B]
D203  WS2812B  [WS2812B]
D204  WS2812B  [WS2812B]
D205  WS2812B  [WS2812B]
D206  WS2812B  [WS2812B]
D207  WS2812B  [WS2812B]
D208  WS2812B  [WS2812B]
D209  WS2812B  [WS2812B]
D210  WS2812B  [WS2812B]
D211  WS2812B  [WS2812B]
D212  WS2812B  [WS2812B]
D213  WS2812B  [WS2812B]
D214  WS2812B  [WS2812B]
D215  WS2812B  [WS2812B]
D216  WS2812B  [WS2812B]
D217  WS2812B  [WS2812B]
D218  WS2812B  [WS2812B]
D219  WS2812B  [WS2812B]
D220  WS2812B  [WS2812B]
D221  WS2812B  [WS2812B]
D222  WS2812B  [WS2812B]
D223  WS2812B  [WS2812B]
D224  WS2812B  [WS2812B]
D225  WS2812B  [WS2812B]

### Nets
5V: C1.1 C2.1 C3.1 C4.1 C5.1 C6.1 C7.1 C8.1 C9.1 C10.1 C11.1 C12.1 C13.1 C14.1 C17.1 C18.1 C19.1 C20.1 C21.1 C22.1 C23.1 C24.1 C25.1 C26.1 C27.1 C28.1 C29.1 C30.1 C31.1 C32.1 C33.1 C34.1 C35.1 C36.1 C37.1 C38.1 C39.1 C40.1 C41.1 C42.1 C43.1 C44.1 C47.1 C48.1 C49.1 C50.1 C51.1 C52.1 C53.1 C54.1 C55.1 C56.1 C57.1 C58.1 C59.1 C60.1 C61.1 C62.1 C63.1 C64.1 C65.1 C66.1 C67.1 C68.1 C69.1 C70.1 C71.1 C72.1 C73.1 C74.1 C77.1 C78.1 C79.1 C80.1 C81.1 C82.1 C83.1 C84.1 C85.1 C86.1 C87.1 C88.1 C89.1 C90.1 C91.1 C92.1 C93.1 C94.1 C95.1 C96.1 C97.1 C98.1 C99.1 C100.1 C101.1 C102.1 C103.1 C104.1 C107.1 C108.1 C109.1 C110.1 C111.1 C112.1 C113.1 C114.1 C115.1 C116.1 C117.1 C118.1 C119.1 C120.1 C121.1 C122.1 C123.1 C124.1 C125.1 C126.1 C127.1 C128.1 C129.1 C130.1 C131.1 C132.1 C133.1 C134.1 C137.1 C138.1 C139.1 C140.1 C141.1 C142.1 C143.1 C144.1 C145.1 C146.1 C147.1 C148.1 C149.1 C150.1 C151.1 C152.1 C153.1 C154.1 C155.1 C156.1 C157.1 C158.1 C159.1 C160.1 C161.1 C162.1 C163.1 C164.1 C167.1 C168.1 C169.1 C170.1 C171.1 C172.1 C173.1 C174.1 C175.1 C176.1 C177.1 C178.1 C179.1 C180.1 C181.1 C182.1 C183.1 C184.1 C185.1 C186.1 C187.1 C188.1 C189.1 C190.1 C191.1 C192.1 C193.1 C194.1 C197.1 C198.1 C199.1 C200.1 C201.1 C202.1 C203.1 C204.1 C205.1 C206.1 C207.1 C208.1 C209.1 C210.1 C211.1 C212.1 C213.1 C214.1 C215.1 C216.1 C217.1 C218.1 C219.1 C220.1 C221.1 C222.1 C223.1 C224.1 D1.3(VSS) D2.3(VSS) D3.3(VSS) D4.3(VSS) D5.3(VSS) D6.3(VSS) D7.3(VSS) D8.3(VSS) D9.3(VSS) D10.3(VSS) D11.3(VSS) D12.3(VSS) D13.3(VSS) D14.3(VSS) D15.3(VSS) D16.3(VSS) D17.3(VSS) D18.3(VSS) D19.3(VSS) D20.3(VSS) D21.3(VSS) D22.3(VSS) D23.3(VSS) D24.3(VSS) D25.3(VSS) D26.3(VSS) D27.3(VSS) D28.3(VSS) D29.3(VSS) D30.3(VSS) D31.3(VSS) D32.3(VSS) D33.3(VSS) D34.3(VSS) D35.3(VSS) D36.3(VSS) D37.3(VSS) D38.3(VSS) D39.3(VSS) D40.3(VSS) D41.3(VSS) D42.3(VSS) D43.3(VSS) D44.3(VSS) D45.3(VSS) D46.3(VSS) D47.3(VSS) D48.3(VSS) D49.3(VSS) D50.3(VSS) D51.3(VSS) D52.3(VSS) D53.3(VSS) D54.3(VSS) D55.3(VSS) D56.3(VSS) D57.3(VSS) D58.3(VSS) D59.3(VSS) D60.3(VSS) D61.3(VSS) D62.3(VSS) D63.3(VSS) D64.3(VSS) D65.3(VSS) D66.3(VSS) D67.3(VSS) D68.3(VSS) D69.3(VSS) D70.3(VSS) D71.3(VSS) D72.3(VSS) D73.3(VSS) D74.3(VSS) D75.3(VSS) D76.3(VSS) D77.3(VSS) D78.3(VSS) D79.3(VSS) D80.3(VSS) D81.3(VSS) D82.3(VSS) D83.3(VSS) D84.3(VSS) D85.3(VSS) D86.3(VSS) D87.3(VSS) D88.3(VSS) D89.3(VSS) D90.3(VSS) D91.3(VSS) D92.3(VSS) D93.3(VSS) D94.3(VSS) D95.3(VSS) D96.3(VSS) D97.3(VSS) D98.3(VSS) D99.3(VSS) D100.3(VSS) D101.3(VSS) D102.3(VSS) D103.3(VSS) D104.3(VSS) D105.3(VSS) D106.3(VSS) D107.3(VSS) D108.3(VSS) D109.3(VSS) D110.3(VSS) D111.3(VSS) D112.3(VSS) D113.3(VSS) D114.3(VSS) D115.3(VSS) D116.3(VSS) D117.3(VSS) D118.3(VSS) D119.3(VSS) D120.3(VSS) D121.3(VSS) D122.3(VSS) D123.3(VSS) D124.3(VSS) D125.3(VSS) D126.3(VSS) D127.3(VSS) D128.3(VSS) D129.3(VSS) D130.3(VSS) D131.3(VSS) D132.3(VSS) D133.3(VSS) D134.3(VSS) D135.3(VSS) D136.3(VSS) D137.3(VSS) D138.3(VSS) D139.3(VSS) D140.3(VSS) D141.3(VSS) D142.3(VSS) D143.3(VSS) D144.3(VSS) D145.3(VSS) D146.3(VSS) D147.3(VSS) D148.3(VSS) D149.3(VSS) D150.3(VSS) D151.3(VSS) D152.3(VSS) D153.3(VSS) D154.3(VSS) D155.3(VSS) D156.3(VSS) D157.3(VSS) D158.3(VSS) D159.3(VSS) D160.3(VSS) D161.3(VSS) D162.3(VSS) D163.3(VSS) D164.3(VSS) D165.3(VSS) D166.3(VSS) D167.3(VSS) D168.3(VSS) D169.3(VSS) D170.3(VSS) D171.3(VSS) D172.3(VSS) D173.3(VSS) D174.3(VSS) D175.3(VSS) D176.3(VSS) D177.3(VSS) D178.3(VSS) D179.3(VSS) D180.3(VSS) D181.3(VSS) D182.3(VSS) D183.3(VSS) D184.3(VSS) D185.3(VSS) D186.3(VSS) D187.3(VSS) D188.3(VSS) D189.3(VSS) D190.3(VSS) D191.3(VSS) D192.3(VSS) D193.3(VSS) D194.3(VSS) D195.3(VSS) D196.3(VSS) D197.3(VSS) D198.3(VSS) D199.3(VSS) D200.3(VSS) D201.3(VSS) D202.3(VSS) D203.3(VSS) D204.3(VSS) D205.3(VSS) D206.3(VSS) D207.3(VSS) D208.3(VSS) D209.3(VSS) D210.3(VSS) D211.3(VSS) D212.3(VSS) D213.3(VSS) D214.3(VSS) D215.3(VSS) D216.3(VSS) D217.3(VSS) D218.3(VSS) D219.3(VSS) D220.3(VSS) D221.3(VSS) D222.3(VSS) D223.3(VSS) D224.3(VSS) D225.3(VSS) ; also sheet 1,2,4
GND: C1.2 C2.2 C3.2 C4.2 C5.2 C6.2 C7.2 C8.2 C9.2 C10.2 C11.2 C12.2 C13.2 C14.2 C17.2 C18.2 C19.2 C20.2 C21.2 C22.2 C23.2 C24.2 C25.2 C26.2 C27.2 C28.2 C29.2 C30.2 C31.2 C32.2 C33.2 C34.2 C35.2 C36.2 C37.2 C38.2 C39.2 C40.2 C41.2 C42.2 C43.2 C44.2 C47.2 C48.2 C49.2 C50.2 C51.2 C52.2 C53.2 C54.2 C55.2 C56.2 C57.2 C58.2 C59.2 C60.2 C61.2 C62.2 C63.2 C64.2 C65.2 C66.2 C67.2 C68.2 C69.2 C70.2 C71.2 C72.2 C73.2 C74.2 C77.2 C78.2 C79.2 C80.2 C81.2 C82.2 C83.2 C84.2 C85.2 C86.2 C87.2 C88.2 C89.2 C90.2 C91.2 C92.2 C93.2 C94.2 C95.2 C96.2 C97.2 C98.2 C99.2 C100.2 C101.2 C102.2 C103.2 C104.2 C107.2 C108.2 C109.2 C110.2 C111.2 C112.2 C113.2 C114.2 C115.2 C116.2 C117.2 C118.2 C119.2 C120.2 C121.2 C122.2 C123.2 C124.2 C125.2 C126.2 C127.2 C128.2 C129.2 C130.2 C131.2 C132.2 C133.2 C134.2 C137.2 C138.2 C139.2 C140.2 C141.2 C142.2 C143.2 C144.2 C145.2 C146.2 C147.2 C148.2 C149.2 C150.2 C151.2 C152.2 C153.2 C154.2 C155.2 C156.2 C157.2 C158.2 C159.2 C160.2 C161.2 C162.2 C163.2 C164.2 C167.2 C168.2 C169.2 C170.2 C171.2 C172.2 C173.2 C174.2 C175.2 C176.2 C177.2 C178.2 C179.2 C180.2 C181.2 C182.2 C183.2 C184.2 C185.2 C186.2 C187.2 C188.2 C189.2 C190.2 C191.2 C192.2 C193.2 C194.2 C197.2 C198.2 C199.2 C200.2 C201.2 C202.2 C203.2 C204.2 C205.2 C206.2 C207.2 C208.2 C209.2 C210.2 C211.2 C212.2 C213.2 C214.2 C215.2 C216.2 C217.2 C218.2 C219.2 C220.2 C221.2 C222.2 C223.2 C224.2 D1.1(VDD) D2.1(VDD) D3.1(VDD) D4.1(VDD) D5.1(VDD) D6.1(VDD) D7.1(VDD) D8.1(VDD) D9.1(VDD) D10.1(VDD) D11.1(VDD) D12.1(VDD) D13.1(VDD) D14.1(VDD) D15.1(VDD) D16.1(VDD) D17.1(VDD) D18.1(VDD) D19.1(VDD) D20.1(VDD) D21.1(VDD) D22.1(VDD) D23.1(VDD) D24.1(VDD) D25.1(VDD) D26.1(VDD) D27.1(VDD) D28.1(VDD) D29.1(VDD) D30.1(VDD) D31.1(VDD) D32.1(VDD) D33.1(VDD) D34.1(VDD) D35.1(VDD) D36.1(VDD) D37.1(VDD) D38.1(VDD) D39.1(VDD) D40.1(VDD) D41.1(VDD) D42.1(VDD) D43.1(VDD) D44.1(VDD) D45.1(VDD) D46.1(VDD) D47.1(VDD) D48.1(VDD) D49.1(VDD) D50.1(VDD) D51.1(VDD) D52.1(VDD) D53.1(VDD) D54.1(VDD) D55.1(VDD) D56.1(VDD) D57.1(VDD) D58.1(VDD) D59.1(VDD) D60.1(VDD) D61.1(VDD) D62.1(VDD) D63.1(VDD) D64.1(VDD) D65.1(VDD) D66.1(VDD) D67.1(VDD) D68.1(VDD) D69.1(VDD) D70.1(VDD) D71.1(VDD) D72.1(VDD) D73.1(VDD) D74.1(VDD) D75.1(VDD) D76.1(VDD) D77.1(VDD) D78.1(VDD) D79.1(VDD) D80.1(VDD) D81.1(VDD) D82.1(VDD) D83.1(VDD) D84.1(VDD) D85.1(VDD) D86.1(VDD) D87.1(VDD) D88.1(VDD) D89.1(VDD) D90.1(VDD) D91.1(VDD) D92.1(VDD) D93.1(VDD) D94.1(VDD) D95.1(VDD) D96.1(VDD) D97.1(VDD) D98.1(VDD) D99.1(VDD) D100.1(VDD) D101.1(VDD) D102.1(VDD) D103.1(VDD) D104.1(VDD) D105.1(VDD) D106.1(VDD) D107.1(VDD) D108.1(VDD) D109.1(VDD) D110.1(VDD) D111.1(VDD) D112.1(VDD) D113.1(VDD) D114.1(VDD) D115.1(VDD) D116.1(VDD) D117.1(VDD) D118.1(VDD) D119.1(VDD) D120.1(VDD) D121.1(VDD) D122.1(VDD) D123.1(VDD) D124.1(VDD) D125.1(VDD) D126.1(VDD) D127.1(VDD) D128.1(VDD) D129.1(VDD) D130.1(VDD) D131.1(VDD) D132.1(VDD) D133.1(VDD) D134.1(VDD) D135.1(VDD) D136.1(VDD) D137.1(VDD) D138.1(VDD) D139.1(VDD) D140.1(VDD) D141.1(VDD) D142.1(VDD) D143.1(VDD) D144.1(VDD) D145.1(VDD) D146.1(VDD) D147.1(VDD) D148.1(VDD) D149.1(VDD) D150.1(VDD) D151.1(VDD) D152.1(VDD) D153.1(VDD) D154.1(VDD) D155.1(VDD) D156.1(VDD) D157.1(VDD) D158.1(VDD) D159.1(VDD) D160.1(VDD) D161.1(VDD) D162.1(VDD) D163.1(VDD) D164.1(VDD) D165.1(VDD) D166.1(VDD) D167.1(VDD) D168.1(VDD) D169.1(VDD) D170.1(VDD) D171.1(VDD) D172.1(VDD) D173.1(VDD) D174.1(VDD) D175.1(VDD) D176.1(VDD) D177.1(VDD) D178.1(VDD) D179.1(VDD) D180.1(VDD) D181.1(VDD) D182.1(VDD) D183.1(VDD) D184.1(VDD) D185.1(VDD) D186.1(VDD) D187.1(VDD) D188.1(VDD) D189.1(VDD) D190.1(VDD) D191.1(VDD) D192.1(VDD) D193.1(VDD) D194.1(VDD) D195.1(VDD) D196.1(VDD) D197.1(VDD) D198.1(VDD) D199.1(VDD) D200.1(VDD) D201.1(VDD) D202.1(VDD) D203.1(VDD) D204.1(VDD) D205.1(VDD) D206.1(VDD) D207.1(VDD) D208.1(VDD) D209.1(VDD) D210.1(VDD) D211.1(VDD) D212.1(VDD) D213.1(VDD) D214.1(VDD) D215.1(VDD) D216.1(VDD) D217.1(VDD) D218.1(VDD) D219.1(VDD) D220.1(VDD) D221.1(VDD) D222.1(VDD) D223.1(VDD) D224.1(VDD) D225.1(VDD) ; also sheet 1,2,4
L_DI_0: D1.4(DI) ; also sheet 1
N$1: D1.2(DO) D2.4(DI)
N$2: D2.2(DO) D3.4(DI)
N$3: D3.2(DO) D4.4(DI)
N$4: D4.2(DO) D5.4(DI)
N$5: D5.2(DO) D6.4(DI)
N$6: D6.2(DO) D7.4(DI)
N$7: D7.2(DO) D8.4(DI)
N$8: D8.2(DO) D9.4(DI)
N$9: D9.2(DO) D10.4(DI)
N$10: D10.2(DO) D11.4(DI)
N$11: D11.2(DO) D12.4(DI)
N$12: D12.2(DO) D13.4(DI)
N$13: D13.2(DO) D14.4(DI)
N$14: D14.2(DO) D15.4(DI)
N$15: D15.2(DO) D16.4(DI)
N$16: D16.2(DO) D17.4(DI)
N$17: D17.2(DO) D18.4(DI)
N$18: D18.2(DO) D19.4(DI)
N$19: D19.2(DO) D20.4(DI)
N$20: D20.2(DO) D21.4(DI)
N$21: D21.2(DO) D22.4(DI)
N$22: D22.2(DO) D23.4(DI)
N$23: D23.2(DO) D24.4(DI)
N$24: D24.2(DO) D25.4(DI)
N$25: D25.2(DO) D26.4(DI)
N$26: D26.2(DO) D27.4(DI)
N$27: D27.2(DO) D28.4(DI)
N$28: D28.2(DO) D29.4(DI)
N$29: D29.2(DO) D30.4(DI)
N$30: D30.2(DO) D31.4(DI)
N$31: D31.2(DO) D32.4(DI)
N$32: D32.2(DO) D33.4(DI)
N$33: D33.2(DO) D34.4(DI)
N$34: D34.2(DO) D35.4(DI)
N$35: D35.2(DO) D36.4(DI)
N$36: D36.2(DO) D37.4(DI)
N$37: D37.2(DO) D38.4(DI)
N$38: D38.2(DO) D39.4(DI)
N$39: D39.2(DO) D40.4(DI)
N$40: D40.2(DO) D41.4(DI)
N$41: D41.2(DO) D42.4(DI)
N$42: D42.2(DO) D43.4(DI)
N$43: D43.2(DO) D44.4(DI)
N$44: D44.2(DO) D45.4(DI)
N$45: D45.2(DO) D46.4(DI)
N$46: D46.2(DO) D47.4(DI)
N$47: D47.2(DO) D48.4(DI)
N$48: D48.2(DO) D49.4(DI)
N$49: D49.2(DO) D50.4(DI)
N$50: D50.2(DO) D51.4(DI)
N$51: D51.2(DO) D52.4(DI)
N$52: D52.2(DO) D53.4(DI)
N$53: D53.2(DO) D54.4(DI)
N$54: D54.2(DO) D55.4(DI)
N$55: D55.2(DO) D56.4(DI)
N$56: D56.2(DO) D57.4(DI)
N$57: D57.2(DO) D58.4(DI)
N$58: D58.2(DO) D59.4(DI)
N$59: D59.2(DO) D60.4(DI)
N$60: D60.2(DO) D61.4(DI)
N$61: D61.2(DO) D62.4(DI)
N$62: D62.2(DO) D63.4(DI)
N$63: D63.2(DO) D64.4(DI)
N$64: D64.2(DO) D65.4(DI)
N$65: D65.2(DO) D66.4(DI)
N$66: D66.2(DO) D67.4(DI)
N$67: D67.2(DO) D68.4(DI)
N$68: D68.2(DO) D69.4(DI)
N$69: D69.2(DO) D70.4(DI)
N$70: D70.2(DO) D71.4(DI)
N$71: D71.2(DO) D72.4(DI)
N$72: D72.2(DO) D73.4(DI)
N$73: D73.2(DO) D74.4(DI)
N$74: D74.2(DO) D75.4(DI)
N$75: D75.2(DO) D76.4(DI)
N$76: D76.2(DO) D77.4(DI)
N$77: D77.2(DO) D78.4(DI)
N$78: D78.2(DO) D79.4(DI)
N$79: D79.2(DO) D80.4(DI)
N$80: D80.2(DO) D81.4(DI)
N$81: D81.2(DO) D82.4(DI)
N$82: D82.2(DO) D83.4(DI)
N$83: D83.2(DO) D84.4(DI)
N$84: D84.2(DO) D85.4(DI)
N$85: D85.2(DO) D86.4(DI)
N$86: D86.2(DO) D87.4(DI)
N$87: D87.2(DO) D88.4(DI)
N$88: D88.2(DO) D89.4(DI)
N$89: D89.2(DO) D90.4(DI)
N$90: D90.2(DO) D91.4(DI)
N$91: D91.2(DO) D92.4(DI)
N$92: D92.2(DO) D93.4(DI)
N$93: D93.2(DO) D94.4(DI)
N$94: D94.2(DO) D95.4(DI)
N$95: D95.2(DO) D96.4(DI)
N$96: D96.2(DO) D97.4(DI)
N$97: D97.2(DO) D98.4(DI)
N$98: D98.2(DO) D99.4(DI)
N$99: D99.2(DO) D100.4(DI)
N$100: D100.2(DO) D101.4(DI)
N$101: D101.2(DO) D102.4(DI)
N$102: D102.2(DO) D103.4(DI)
N$103: D103.2(DO) D104.4(DI)
N$104: D104.2(DO) D105.4(DI)
N$105: D105.2(DO) D106.4(DI)
N$106: D106.2(DO) D107.4(DI)
N$107: D107.2(DO) D108.4(DI)
N$108: D108.2(DO) D109.4(DI)
N$109: D109.2(DO) D110.4(DI)
N$111: D110.2(DO) D111.4(DI)
N$112: D111.2(DO) D112.4(DI)
N$113: D112.2(DO) D113.4(DI)
N$114: D113.2(DO) D114.4(DI)
N$115: D114.2(DO) D115.4(DI)
N$116: D115.2(DO) D116.4(DI)
N$117: D116.2(DO) D117.4(DI)
N$118: D117.2(DO) D118.4(DI)
N$119: D118.2(DO) D119.4(DI)
N$120: D119.2(DO) D120.4(DI)
N$129: D120.2(DO) D121.4(DI)
N$130: D121.2(DO) D122.4(DI)
N$131: D122.2(DO) D123.4(DI)
N$132: D123.2(DO) D124.4(DI)
N$133: D124.2(DO) D125.4(DI)
N$134: D125.2(DO) D126.4(DI)
N$135: D126.2(DO) D127.4(DI)
N$136: D127.2(DO) D128.4(DI)
N$137: D128.2(DO) D129.4(DI)
N$138: D129.2(DO) D130.4(DI)
N$139: D130.2(DO) D131.4(DI)
N$147: D131.2(DO) D132.4(DI)
N$148: D132.2(DO) D133.4(DI)
N$149: D133.2(DO) D134.4(DI)
N$150: D134.2(DO) D135.4(DI)
N$151: D135.2(DO) D136.4(DI)
N$152: D136.2(DO) D137.4(DI)
N$153: D137.2(DO) D138.4(DI)
N$154: D138.2(DO) D139.4(DI)
N$155: D139.2(DO) D140.4(DI)
N$156: D140.2(DO) D141.4(DI)
N$165: D141.2(DO) D142.4(DI)
N$166: D142.2(DO) D143.4(DI)
N$167: D143.2(DO) D144.4(DI)
N$168: D144.2(DO) D145.4(DI)
N$169: D145.2(DO) D146.4(DI)
N$170: D146.2(DO) D147.4(DI)
N$171: D147.2(DO) D148.4(DI)
N$172: D148.2(DO) D149.4(DI)
N$173: D149.2(DO) D150.4(DI)
N$174: D150.2(DO) D151.4(DI)
N$183: D151.2(DO) D152.4(DI)
N$184: D152.2(DO) D153.4(DI)
N$185: D153.2(DO) D154.4(DI)
N$186: D154.2(DO) D155.4(DI)
N$187: D155.2(DO) D156.4(DI)
N$188: D156.2(DO) D157.4(DI)
N$189: D157.2(DO) D158.4(DI)
N$190: D158.2(DO) D159.4(DI)
N$191: D159.2(DO) D160.4(DI)
N$192: D160.2(DO) D161.4(DI)
N$201: D161.2(DO) D162.4(DI)
N$202: D162.2(DO) D163.4(DI)
N$203: D163.2(DO) D164.4(DI)
N$204: D164.2(DO) D165.4(DI)
N$205: D165.2(DO) D166.4(DI)
N$206: D166.2(DO) D167.4(DI)
N$207: D167.2(DO) D168.4(DI)
N$208: D168.2(DO) D169.4(DI)
N$209: D169.2(DO) D170.4(DI)
N$210: D170.2(DO) D171.4(DI)
N$255: D171.2(DO) D172.4(DI)
N$256: D172.2(DO) D173.4(DI)
N$257: D173.2(DO) D174.4(DI)
N$258: D174.2(DO) D175.4(DI)
N$259: D175.2(DO) D176.4(DI)
N$260: D176.2(DO) D177.4(DI)
N$261: D177.2(DO) D178.4(DI)
N$262: D178.2(DO) D179.4(DI)
N$263: D179.2(DO) D180.4(DI)
N$264: D180.2(DO) D181.4(DI)
N$265: D181.2(DO) D182.4(DI)
N$266: D182.2(DO) D183.4(DI)
N$267: D183.2(DO) D184.4(DI)
N$268: D184.2(DO) D185.4(DI)
N$269: D185.2(DO) D186.4(DI)
N$270: D186.2(DO) D187.4(DI)
N$271: D187.2(DO) D188.4(DI)
N$272: D188.2(DO) D189.4(DI)
N$273: D189.2(DO) D190.4(DI)
N$274: D190.2(DO) D191.4(DI)
N$275: D191.2(DO) D192.4(DI)
N$276: D192.2(DO) D193.4(DI)
N$277: D193.2(DO) D194.4(DI)
N$278: D194.2(DO) D195.4(DI)
N$279: D195.2(DO) D196.4(DI)
N$280: D196.2(DO) D197.4(DI)
N$281: D197.2(DO) D198.4(DI)
N$282: D198.2(DO) D199.4(DI)
N$283: D199.2(DO) D200.4(DI)
N$284: D200.2(DO) D201.4(DI)
N$285: D201.2(DO) D202.4(DI)
N$286: D202.2(DO) D203.4(DI)
N$287: D203.2(DO) D204.4(DI)
N$288: D204.2(DO) D205.4(DI)
N$289: D205.2(DO) D206.4(DI)
N$290: D206.2(DO) D207.4(DI)
N$291: D207.2(DO) D208.4(DI)
N$292: D208.2(DO) D209.4(DI)
N$293: D209.2(DO) D210.4(DI)
N$294: D210.2(DO) D211.4(DI)
N$295: D211.2(DO) D212.4(DI)
N$296: D212.2(DO) D213.4(DI)
N$297: D213.2(DO) D214.4(DI)
N$298: D214.2(DO) D215.4(DI)
N$299: D215.2(DO) D216.4(DI)
N$300: D216.2(DO) D217.4(DI)
N$301: D217.2(DO) D218.4(DI)
N$302: D218.2(DO) D219.4(DI)
N$303: D219.2(DO) D220.4(DI)
N$304: D220.2(DO) D221.4(DI)
N$305: D221.2(DO) D222.4(DI)
N$306: D222.2(DO) D223.4(DI)
N$307: D223.2(DO) D224.4(DI)
N$308: D224.2(DO) D225.4(DI)
Unconnected: D225.2(DO)

## Sheet 4 of 4
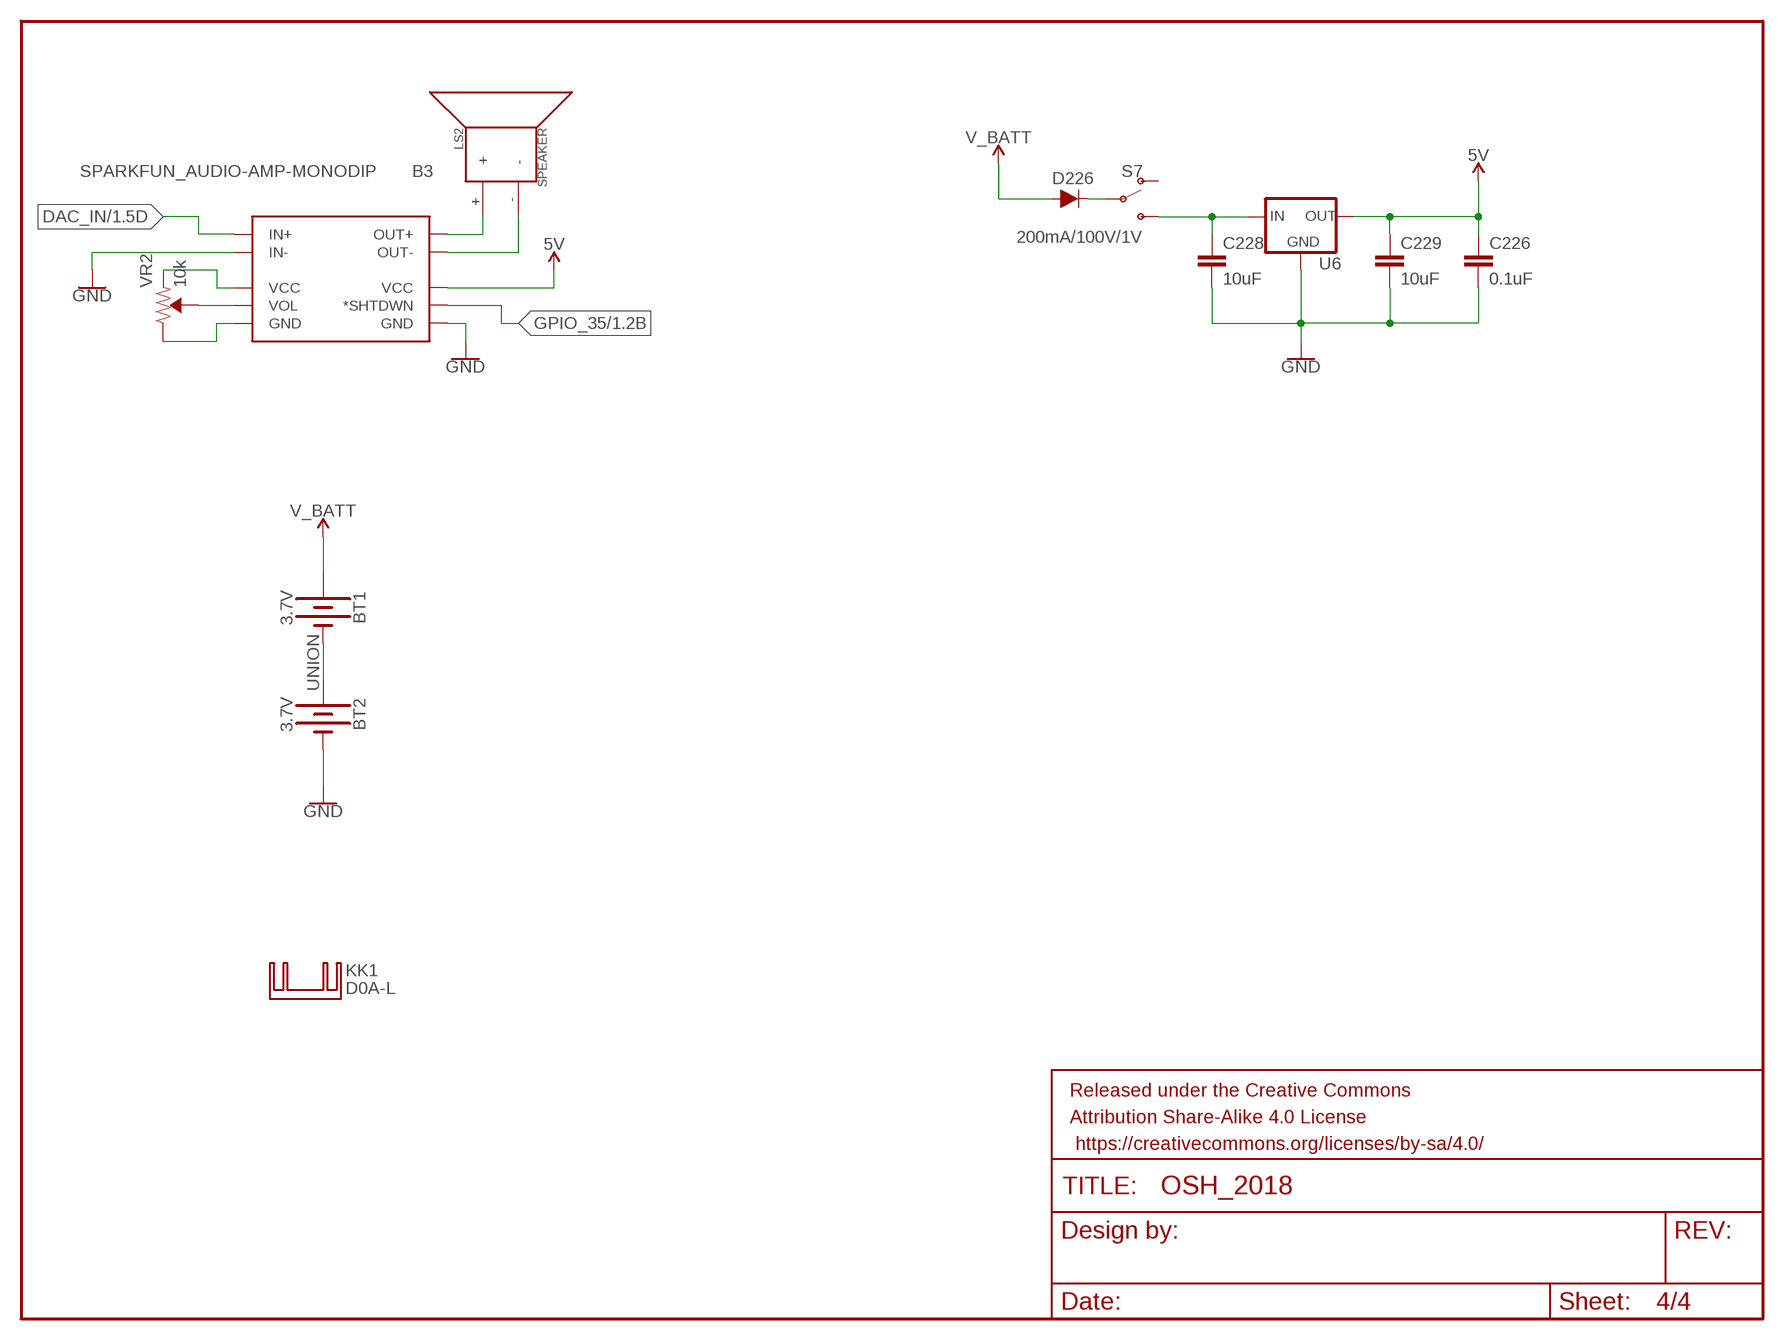
[diagram p4: schematic, sheet 4]

### Parts
B3  SPARKFUN_AUDIO-AMP-MONODIP  [AUDIO-AMP-MONO]
BT1  3.7V  BATTERY-18650  [BATTERY_18650-HOLDER]
BT2  3.7V  BATTERY-18650  [BATTERY_18650-HOLDER]
C226  0.1uF  0.1UF-0603-25V-(+80/-20%)  [0603]
C228  10uF  10UF-0603-6.3V-20%  [0603]
C229  10uF  10UF-0603-6.3V-20%  [0603]
D226  200mA/100V/1V  DIODE-1N4148  [DIODE-1N4148]
FRAME3  FRAME-LETTERNO_PACKAGE  [DUMMY]
KK1  D0A-L  [D02A-L]
LS2  SPEAKER  [PCB_MOUNT_SPEAKER]
S7  SWITCH-SPDT-SMD-RIGHT-ANGLE  [SWITCH_SPST_SMD_A]
U6  V_REG_78XX-TO-220  [TO-220-ALT]
VR2  10k  TRIMPOT-PTH-10MM-KNOB-1/2W-10%  [TRIMPOT-PTH-3386U]

### Nets
5V: B3.PWR+(VCC) C226.1 C229.1 U6.OUT ; also sheet 1,2,3
DAC_IN: B3.IN+ ; also sheet 1
GND: B3.IN- B3.PWR-(GND) BT2.GND@1(-) C226.2 C228.2 C229.2 U6.GND ; also sheet 1,2,3
GPIO_35: B3.S(*SHTDWN) ; also sheet 1
N$140: C228.1 S7.3(S) U6.IN
N$159: D226.C S7.2(P)
N$310: B3.OUT- LS2.-
N$311: B3.OUT+ LS2.+
N$312: B3.VOL VR2.2(WIPER)
N$313: B3.VOL-(GND) VR2.3(CW)
N$314: B3.VOL+(VCC) VR2.1(CCW)
UNION: BT1.GND@1(-) BT2.PWR@1(+)
V_BATT: BT1.PWR@1(+) D226.A
Unconnected: S7.1(O)

## Library data of the parts
B2 = SparkFun-Boards:ESP32_THING: SparkFun ESP32 Thing Board Pins, silkscreen, and logos matching the layout of the SparkFun ESP32 Thing <https://www.sparkfun.com/products/13907> Dimensions: 2.32" x 1.00"
B3 = SparkFun-Boards:SPARKFUN_AUDIO-AMP-MONO: SparkFun Mono Audio Amp Breakout- TPA2005D1 This tiny audio amplifier is based on the Texas Instruments TPA2005D1. Its efficient class-D operation means low heat and long battery life. It can drive an 8-Ohm speaker at up to 1.4 Watts SparkFun Products: Mono Audio Amp Breakout <https://www.sparkfun.com/products/11044>
BT1 BT2 = SparkFun-Batteries:BATTERY: Battery - Single Cell A variety of battery chemistries, sizes, and footprints. Device List: 20MM_PTH - Coin Cell Battery Holder - 20mm (PTH) <https://www.sparkfun.com/products/783> 6.8MM_PTH - Coin Cell Battery Holder - 6.8MM(SMD) <https://www.digikey.com/product-detail/en/seiko-instruments/MS621FE-FL11E/728-1057-ND/1889208?WT.srch=1&gclid=CNOQ5a6LzdQCFZS2wAodXCkE0g> 12MM_SMD - Coin Cell Battery Holder - 12mm (SMD) <https://www.sparkfun.com/products/10592> 12MM_PTH - Coin Cell Battery Holder - 12mm (PTH) <https://www.sparkfun.com/products/7948> 20MM_SMD - 20mm Coin Cell Battery Holder (SMD) (2 legs) Used on the Big Time Watch Kit <https://www.sparkfun.com/products/11734> 20MM_SMD_4LEGS - Coin Cell Battery Holder - 20mm (SMD) <https://www.sparkfun.com/products/11892> 20MM_SMD_4LEGS_OVERPASTE - Coin Cell Battery Holder - 20mm (SMD) <https://www.sparkfun.com/products/11892> (Over-paste on the legs) 24.5MM_PTH - Coin Cell Battery Holder - 24.5mm (PTH) <https://www.sparkfun.com/products/8863> 9V - 9V Battery Holder - PC Mount Used on the SparkFun SparkPunk Sound Kit <https://www.sparkfun.com/products/11177> and SparkFun SparkPunk Sequencer Kit <https://www.sparkfun.com/products/12707> 18650 - Battery Holder - 18650 (PTH) <https://www.sparkfun.com/products/13113> AA - Battery Holder - 1xAA (PTH) <https://www.sparkfun.com/products/7949> AAA - Battery Holder - 1xAAA (PTH) <https://www.sparkfun.com/products/12718> AA_KIT - Battery Holder - 1xAA (PTH) <https://www.sparkfun.com/products/7949> Special kit package - pads only have exposed copper on one side of the board. AAA_KIT - Battery Holder - 1xAAA (PTH) <https://www.sparkfun.com/products/12718> Special kit package - pads only have exposed copper on one side of the board.; PROD_ID: BATT-12327; SF_SKU: PRT-13113
C1-C14 C17-C44 C47-C74 C77-C104 C107-C134 C137-C164 C167-C181 C183-C194 C197-C224 = SparkFun-Capacitors:0.1UF: 0.1µF ceramic capacitors A capacitor is a passive two-terminal electrical component used to store electrical energy temporarily in an electric field.; PROD_ID: CAP-08604
C182 = SparkFun-Capacitors:0.1UF: 0.1µF ceramic capacitors A capacitor is a passive two-terminal electrical component used to store electrical energy temporarily in an electric field.; PROD_ID: CAP-08390
C226 = SparkFun-Capacitors:0.1UF: 0.1µF ceramic capacitors A capacitor is a passive two-terminal electrical component used to store electrical energy temporarily in an electric field.; PROD_ID: CAP-00810
C228 C229 = SparkFun-Capacitors:10UF: 10.0µF ceramic capacitors A capacitor is a passive two-terminal electrical component used to store electrical energy temporarily in an electric field.; PROD_ID: CAP-11015
D1-D225 = SparkFun-LED:WS2812B: WS2812B SMD addressable RGB LED 5x5mm SMD LED with built-in controller IC. Color: Red/Green/Blue mC Rating: RGB: 390, 660, 180 mcd Forward Voltage: RGB: 2.0, 3.0, 3.0 V Packages:WS2812B SparkFun Products: Blynk Board - ESP8266 <https://www.sparkfun.com/products/13794>; PROD_ID: DIO-12503
D226 = SparkFun-DiscreteSemi:DIODE: Diode These are standard reverse protection diodes and small signal diodes. SparkFun Products: SparkFun SparkPunk Sound Kit <https://www.sparkfun.com/products/11177> SparkFun ESP8266 Thing <https://www.sparkfun.com/products/13231>; PROD_ID: DIO-08378
DISPLAY_1-DISPLAY_5 = SparkFun-LED:7-SEGMENT-1DIGIT-1INCH: 7-Segment Display, single digit, 1" EZ is for kits. Pads are only exposed on the bottom side to help prevent soldering in upside down. Datasheet (Red) <https://cdn.sparkfun.com/datasheets/Components/LED/YSD-160AR4B-8.pdf> Datasheet (Blue) <https://cdn.sparkfun.com/datasheets/Components/LED/YSD-160AB3C-8.pdf> SparkFun Products 7-Segment Display - LED (Red) <https://www.sparkfun.com/products/8546> (COM-08546) 7-Segment Display - LED (Blue) <https://www.sparkfun.com/products/9191> (COM-09191); PROD_ID: COMP-09495
FRAME3 = SparkFun-Aesthetics:FRAME-LETTER: Schematic Frame - Letter Standard 8.5x11 US Letter frame; DESIGNER: Nobody; VERSION: v01
KK1 = heatsink:D0A-L: HEATSINK distributor Schukat
LS2 = SparkFun-Electromechanical:SPEAKER: Speaker Generic 2-terminal loudspeakers SparkFun Products Speaker - PCB Mount <https://www.sparkfun.com/products/11089> (COM-11089); PROD_ID: COMP-11789; SF_SKU: COM-11089
R1-R40 = SparkFun-Resistors:330OHM: 330Ω resistor A resistor is a passive two-terminal electrical component that implements electrical resistance as a circuit element. Resistors act to reduce current flow, and, at the same time, act to lower voltage levels within circuits. - Wikipedia; PROD_ID: RES-00818
R41-R46 R48-R56 = SparkFun-Resistors:10KOHM: 10kΩ resistor A resistor is a passive two-terminal electrical component that implements electrical resistance as a circuit element. Resistors act to reduce current flow, and, at the same time, act to lower voltage levels within circuits. - Wikipedia; PROD_ID: RES-00824
S1-S5 = SparkFun-Switches:MOMENTARY-SWITCH-SPST: Momentary Switch (Pushbutton) - SPST Normally-open (NO) SPST momentary switches (buttons, pushbuttons). Variants PTH-12MM - 12mm square, through-hole Momentary Pushbutton Switch - 12mm Square <https://www.sparkfun.com/products/9190> (COM-09190) PTH-6.0MM, PTH-6.0MM-KIT - 6.0mm square, through-hole Mini Pushbutton Switch <https://www.sparkfun.com/products/97> (COM-00097) KIT package intended for soldering kit's - only one side of pads' copper is exposed. PTH-RIGHT-ANGLE-KIT - Right-angle, through-hole Right Angle Tactile Button <https://www.sparkfun.com/products/10791> - Used on SparkFun BigTime Watch Kit <https://www.sparkfun.com/products/11734> SMD-12MM - 12mm square, surface-mount Tactile Button - SMD (12mm) <https://www.sparkfun.com/products/12993> (COM-12993) Used on SparkFun PicoBoard <https://www.sparkfun.com/products/11888> SMD-4.5MM - 4.5mm Square Trackball Switch Used on SparkFun Blackberry Trackballer Breakout <https://www.sparkfun.com/products/13169> SMD-4.6MMX2.8MM - 4.60mm x 2.80mm, surface mount Used on SparkFun SAMD21 Mini Breakout <https://www.sparkfun.com/products/13664> SMD-5.2MM, SMD-5.2-REDUNDANT - 5.2mm square, surface-mount Mini Pushbutton Switch - SMD <https://www.sparkfun.com/products/8720> (COM-08720) Used on Arduino Pro Mini <https://www.sparkfun.com/products/11114> REDUNDANT package connects both switch circuits together SMD-6.0X3.5MM - 6.0 x 3.5mm, surface mount Momentary Reset Switch SMD <https://www.sparkfun.com/products/8229> (COM-08229) SMD-6.2MM-TALL - 6.2mm square, surface mount Tactile Button - SMD (6mm) <https://www.sparkfun.com/products/12992> Used on SparkFun Digital Sandbox <https://www.sparkfun.com/products/12651> SMD-RIGHT-ANGLE - Right-angle, surface mount Used on SparkFun Block for Intel® Edison - Arduino <https://www.sparkfun.com/products/13036>; PROD_ID: SWCH-08247; SF_SKU: COM-08720
S7 = SparkFun-Switches:SWITCH-SPDT: Single Pole, Double Throw (SPDT) Switch Single-pole, double-throw (SPDT) switch. Variant Overview SMD-AYZ0202 Surface Mount DPDT Switch <https://www.sparkfun.com/products/597> (COM-00597) Used on e.g. LilyPad Arduino USB - ATmega32U4 Board <https://www.sparkfun.com/products/12049> PTH-11.6X4.0MM SPDT Mini Power Switch <https://www.sparkfun.com/products/102> (COM-00102) Used on e.g. SparkFun Simon Says - Through-Hole Soldering Kit <https://www.sparkfun.com/products/10547> (KIT-10547) PTH-11.6X4.0MM-KIT KIT version of SPDT Mini Power Switch - Simplifies soldering by removing tStop of switch pins - only one side can be soldered. PTH-11.6X4.0MM-LOCK LOCK version of SPDT Mini Power Switch - Offset pins hold switch in place for easier soldering. SMD-RIGHT-ANGLE Surface Mount Right Angle Switch <https://www.sparkfun.com/products/10860> (COM-10860) Used on e.g. SparkFun ESP8266 Thing <https://www.sparkfun.com/products/13231>; PROD_ID: SWCH-10651; SF_SKU: COM-10860
T1-T5 = we-transistor:MOSFET-N: N-Channel MOSFET SOT23 N-Chn MOSFET TSM3404, TSM240N03 (Vgs>=+/-20V, Vds<=30V, Id>=3A + Rds<=0.05Ohm @ Vgs=4.5V) BSS138 (Vgs>=+/-20V, Vds<=40V, Id>=0.2A + Rds<=3Ohm @ Vgs=4.5V) SOT223 Low Side Switch with Protection (Infineon) BSP76 (Vin=0...10V, Vds<=42V, Id=1.4A + Rds=0.2Ohm @ Vin=5V) BSP77 (Vin=0...10V, Vds<=42V, Id=2.2A + Rds=0.1Ohm @ Vin=5V) D²Pak Low Side Switch with Protection (Infineon) BTS117TC (Vin=0...10V, Vds<=60V, Id=3.5A + Rds=0.12Ohm @ Vin=5V) BTS133TC (Vin=0...10V, Vds<=60V, Id=7A + Rds=0.06Ohm @ Vin=5V) BTS141TC (Vin=0...10V, Vds<=60V, Id=12A + Rds=0.03Ohm @ Vin=5V) BTS3018TC (Vin=0...10V, Vds<=60V, Id=6A + Rds=0.02Ohm @ Vin=5V)
U1-U5 = SparkFun-IC-Logic:74*595: 8-Bit Shift Register (Serial to Parallel) Datasheet <http://cdn.sparkfun.com/datasheets/BreakoutBoards/MM74HC595.pdf> SparkFun Products SparkFun Shift Register Breakout - 74HC595 <https://www.sparkfun.com/products/10680> (BOB-10680); PROD_ID: IC-07875
U6 = SparkFun-IC-Power:V_REG_78XX: Voltage Regulator Standard 78xx regulator. IGO (Input Ground Output). Spark Fun Electronics SKU : COM-00107; PROD_ID: VREG-08450; SF_ID: COM-00107
VR2 = SparkFun-Resistors:TRIMPOT: Trimming Potentiometer (Trimpot) Three-terminal potentiometers, with an adjustable wiper and two adjustable resistors. A pot can be used to create a configurable voltage divider, or as a variable resistor. "Trimpots" are a subset of potentiometers, usually intended for "set-and-forget" applications. They're often more delicate than standard potentiometers - rated for fewer turns. Variants PTH-KNOB - PTH Trimpot w/ finger-adjustable knob Trimpot 10K with Knob <https://www.sparkfun.com/products/9806> (COM-09806) Datasheet <http://www.sparkfun.com/datasheets/Components/General/TSR-3386.pdf> SMD-3MM-CLOSED-FRAME - SMD 3mm Square Closed-Frame Trimpot Used on e.g. EasyDriver - Stepper Motor Driver <https://www.sparkfun.com/products/12779> Datasheet <http://www.bitechnologies.com/pdfs/22.pdf> (22AR10KTR) SMD-5MM - SMD 5mm Square Closed-Frame Trimpot Used on e.g. IOIO-OTG - V2.2 <https://www.sparkfun.com/products/13613> Datasheet <http://www.vishay.com/docs/51008/ts53.pdf> (TS53YL502MR10) SMD-3MM-1/10W-25% - 3mm Square Open-Frame Trimpot Used on e.g. SparkFun Shapeoko <https://www.sparkfun.com/products/13899> Datasheet <http://www.bourns.com/docs/Product-Datasheets/TC33.pdf> (TC33X-2-103E); PROD_ID: RES-09730; SF_SKU: COM-09806